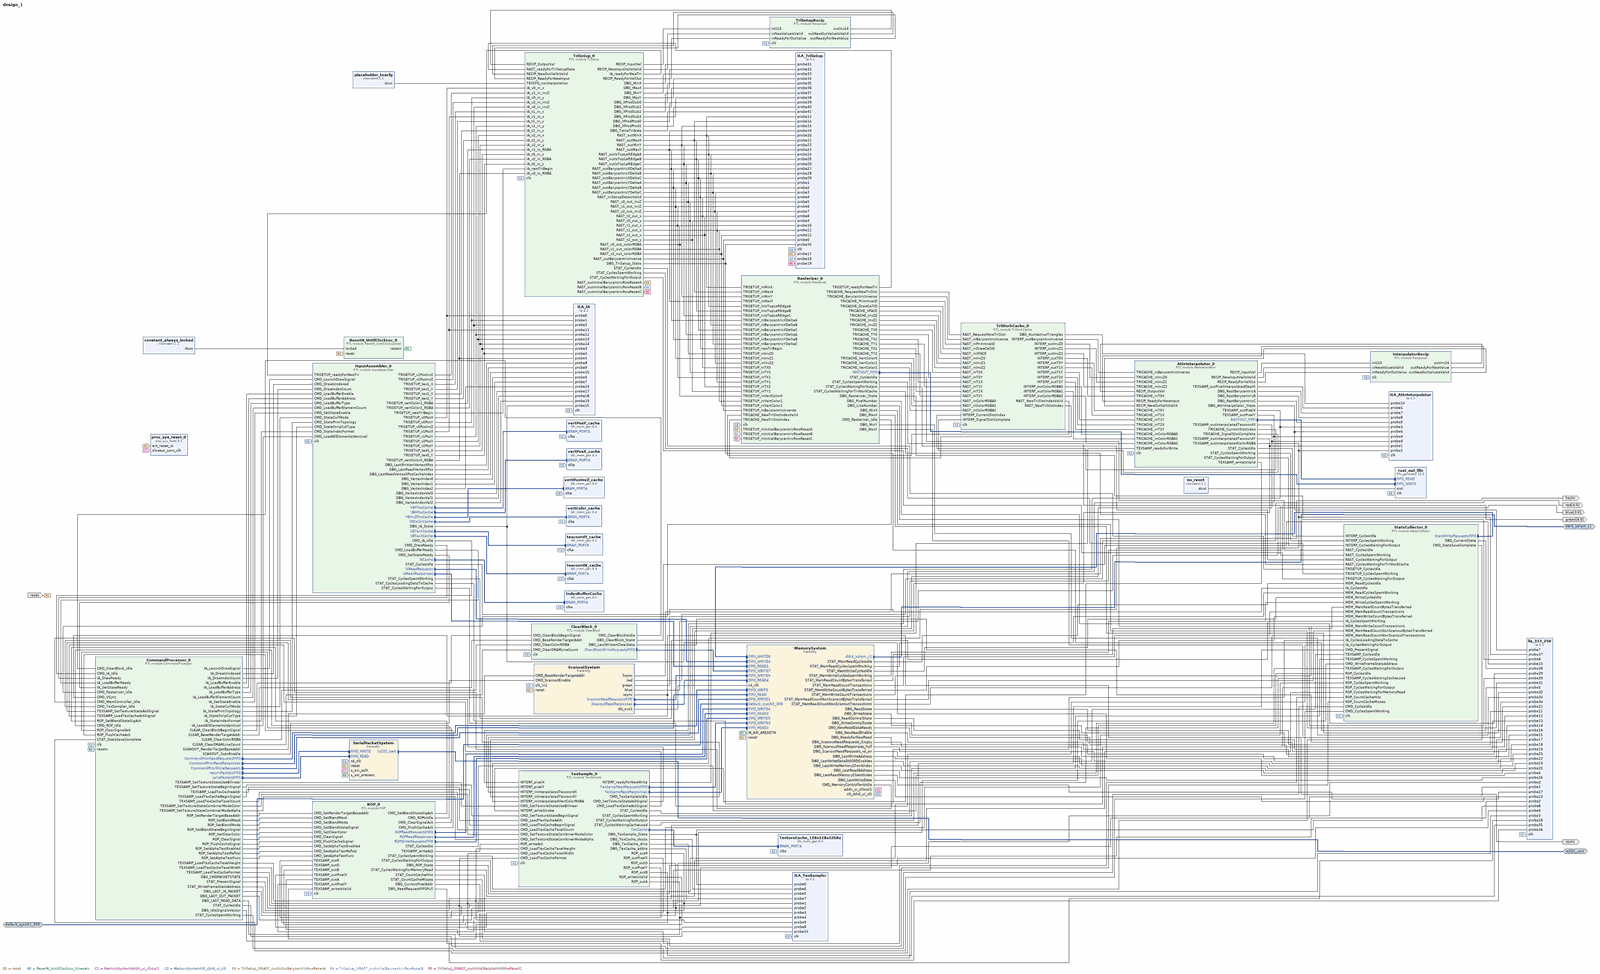
[diagram p0: block diagram of the top level, whole]
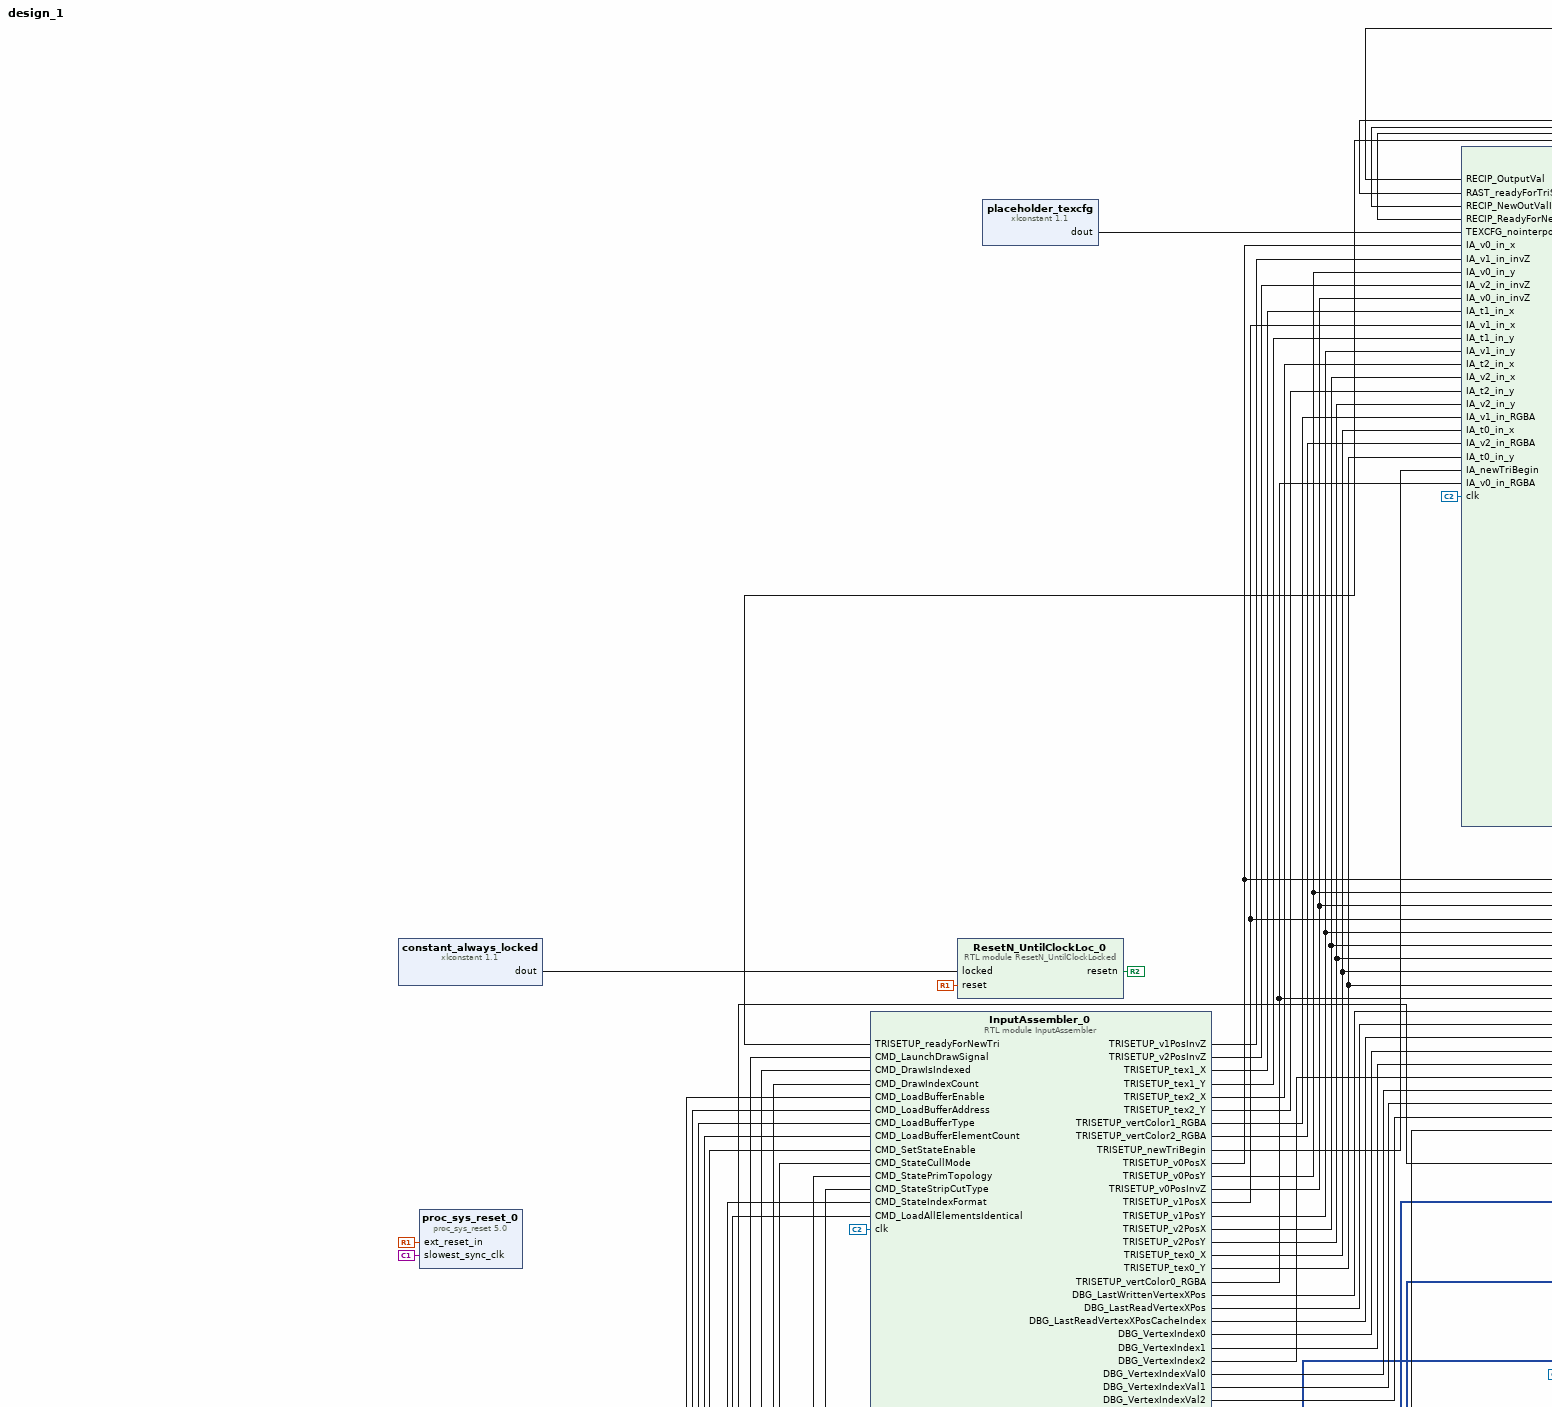
[diagram p1: block diagram of the top level, upper left part]
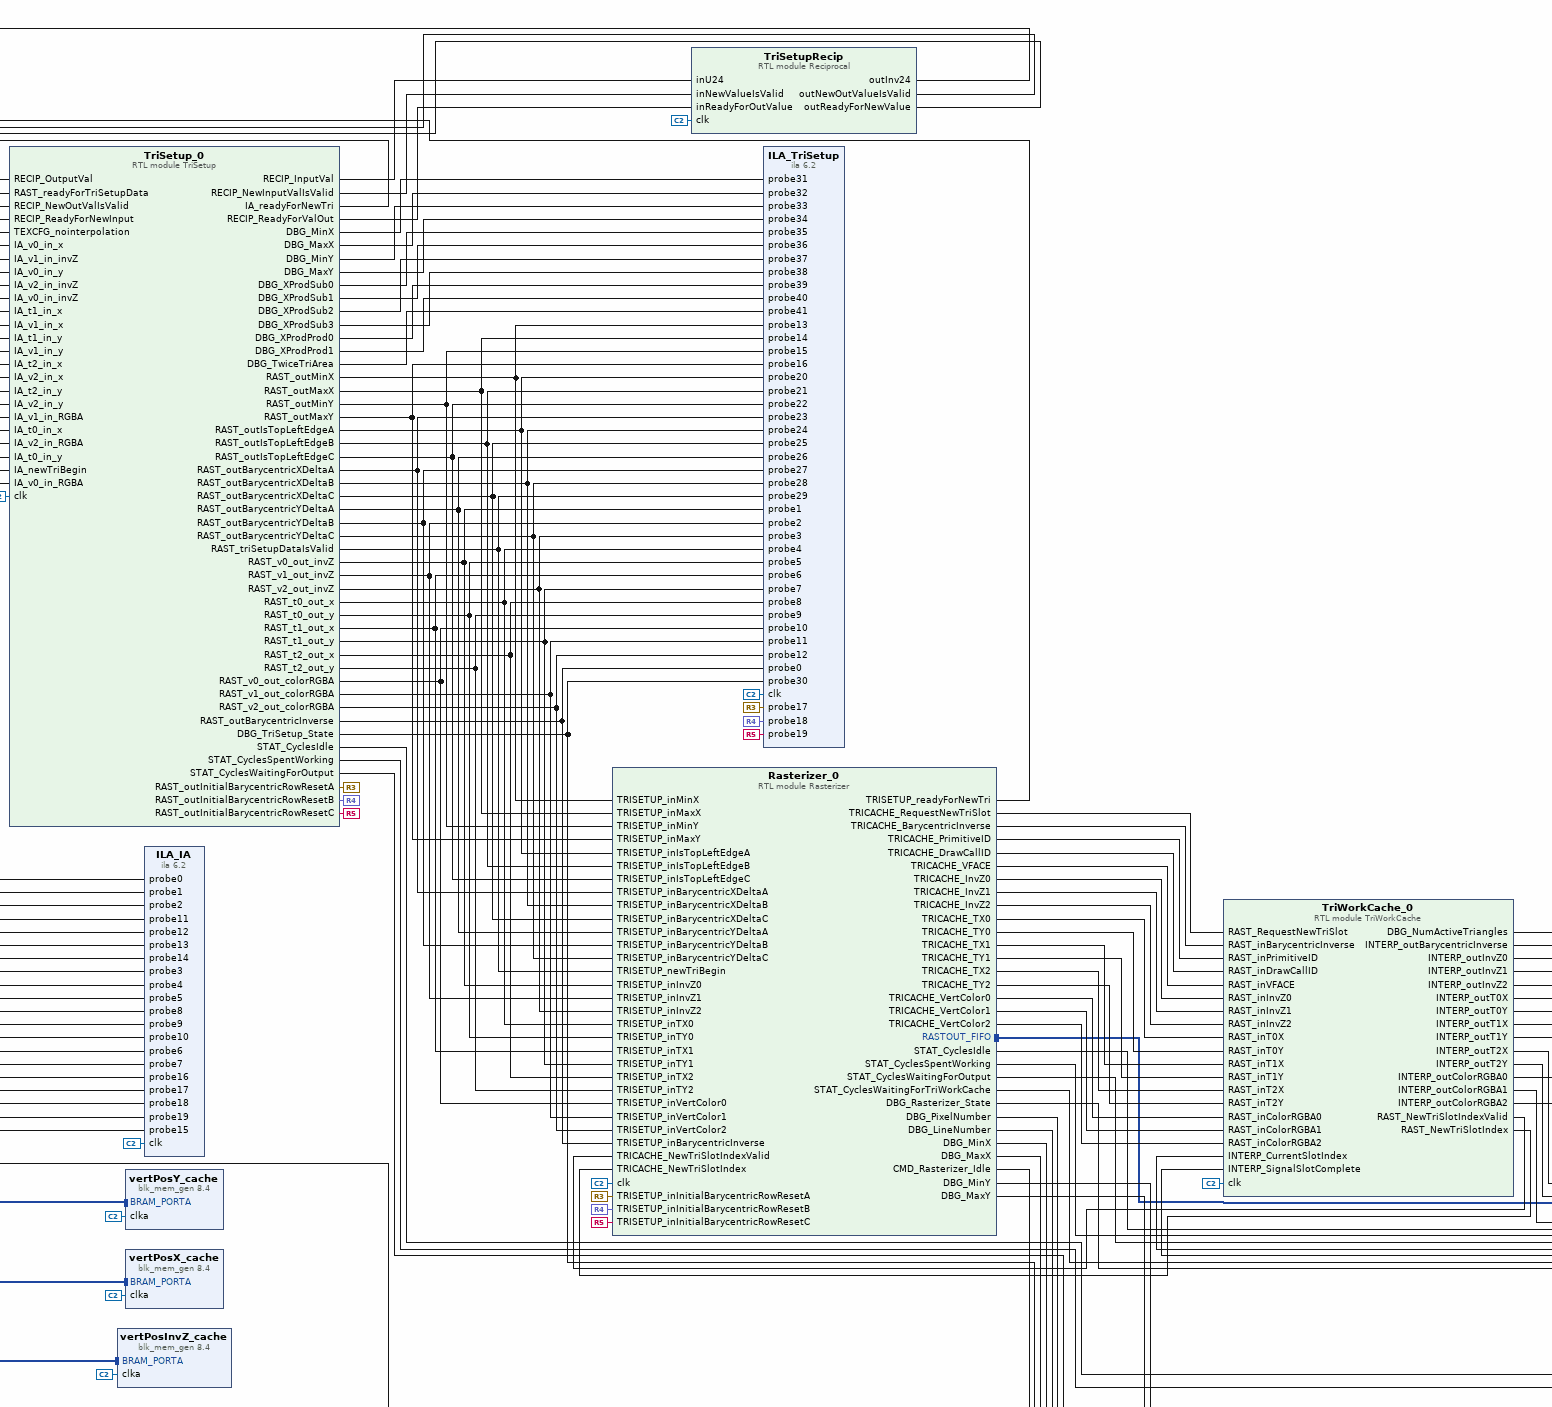
[diagram p2: block diagram of the top level, upper centre part]
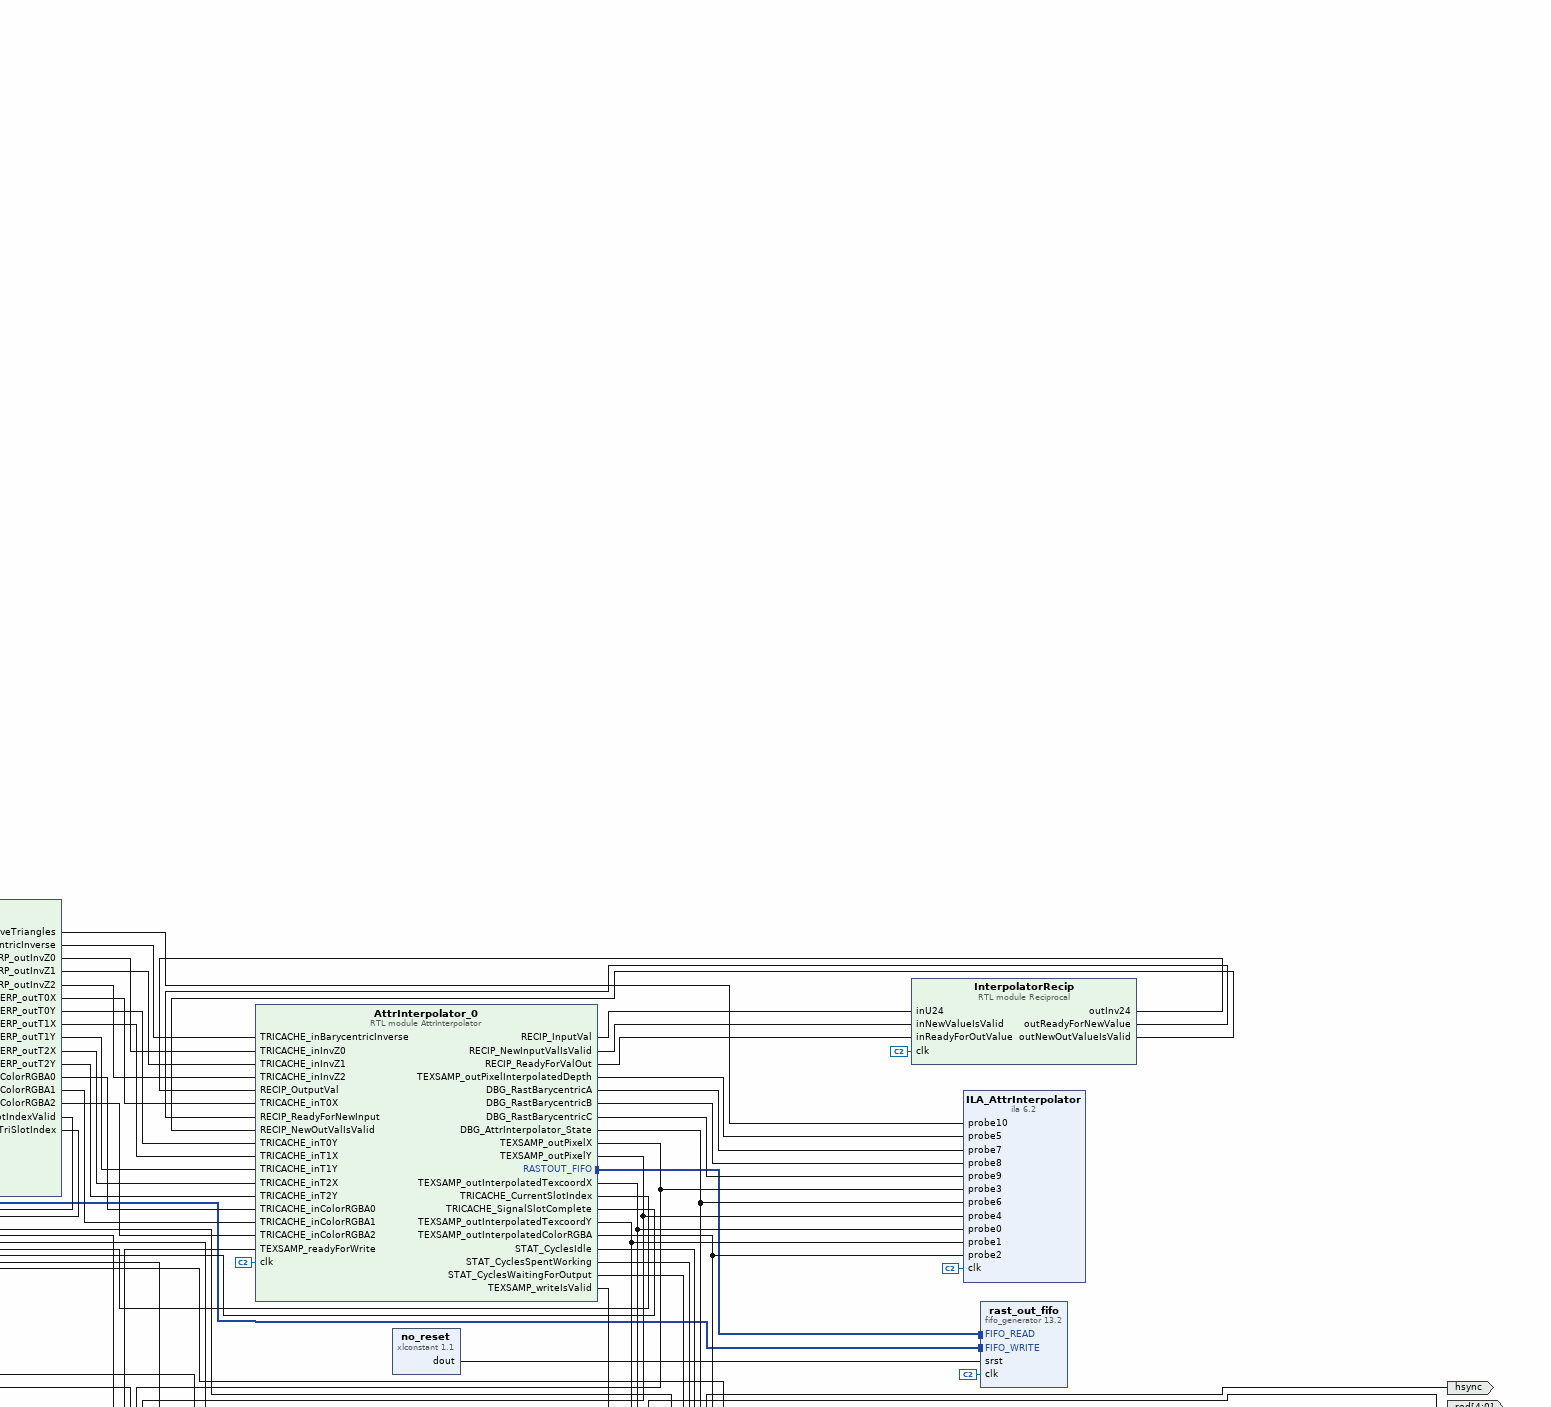
[diagram p3: block diagram of the top level, upper right part]
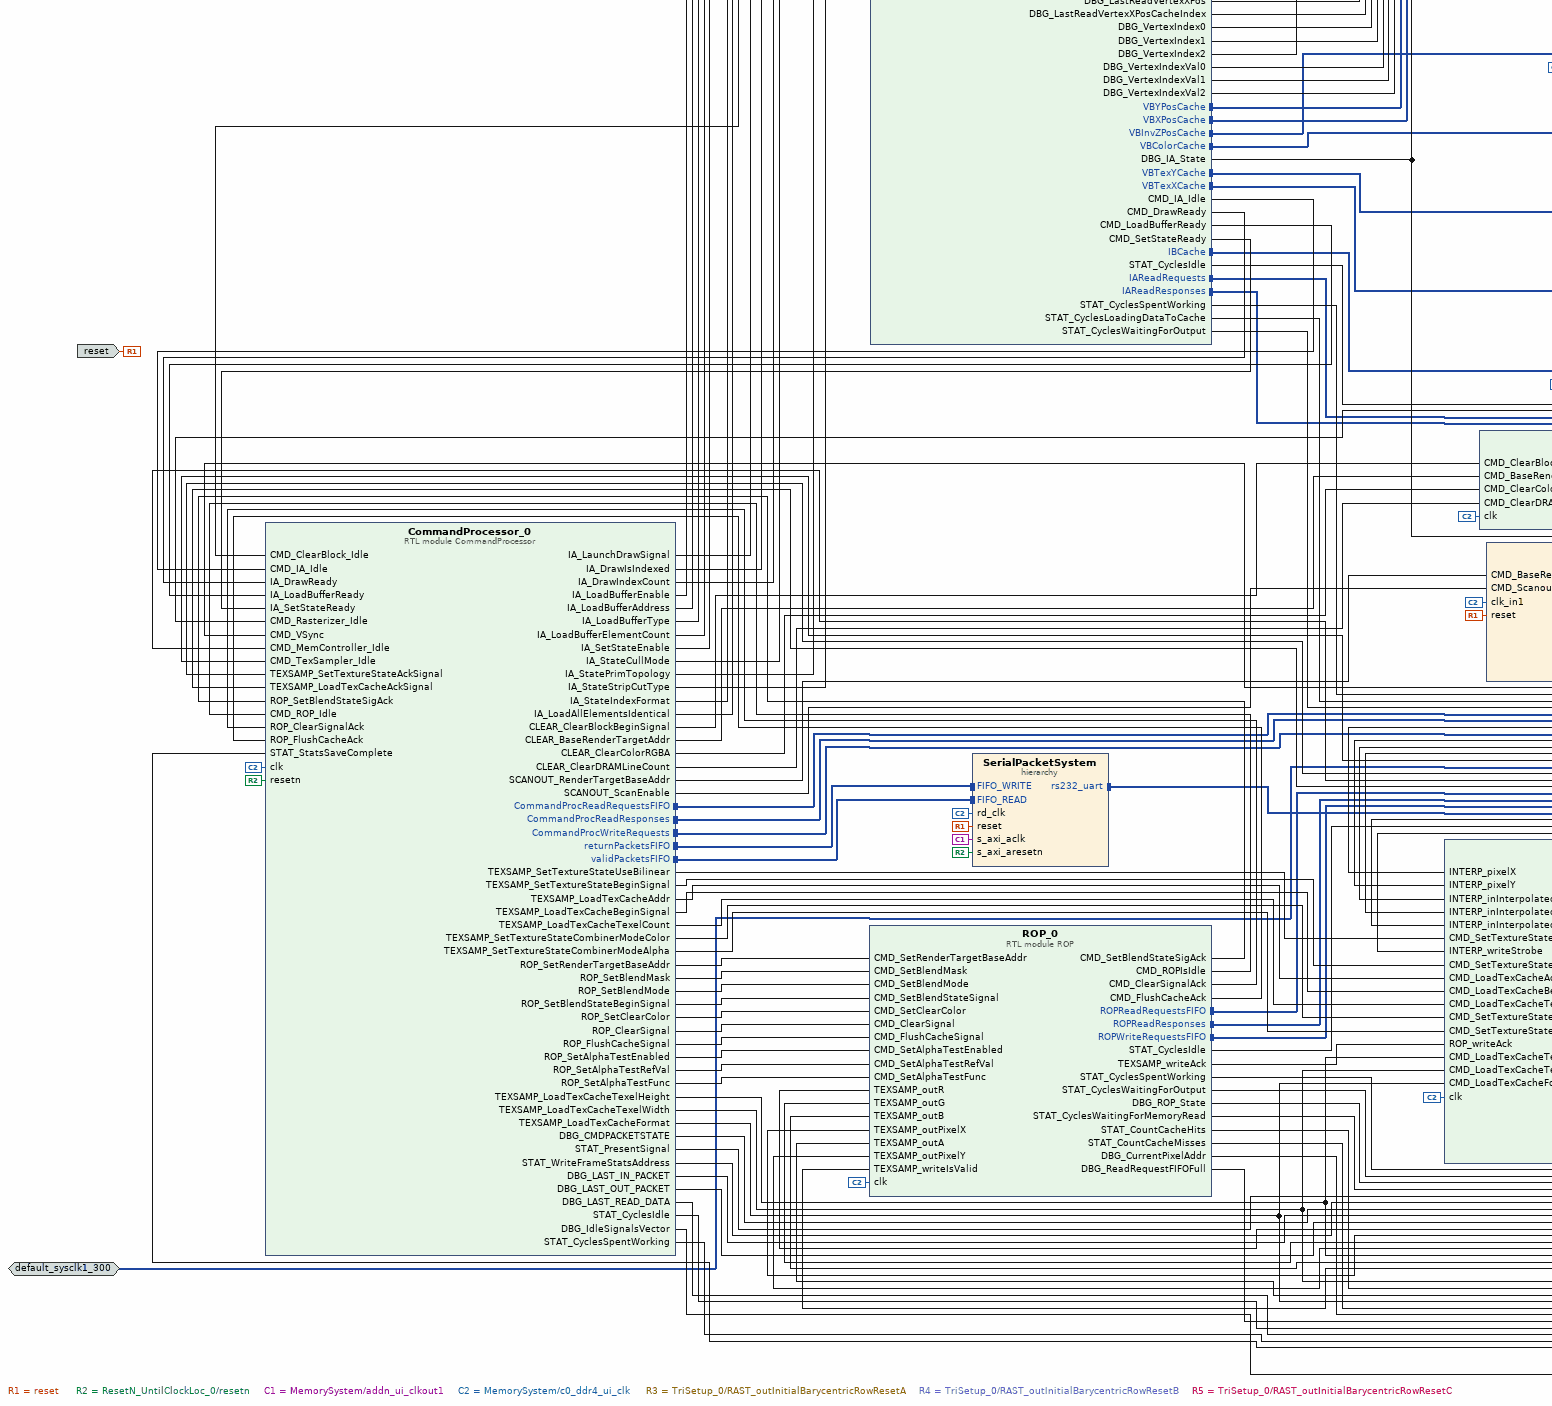
[diagram p4: block diagram of the top level, lower left part]
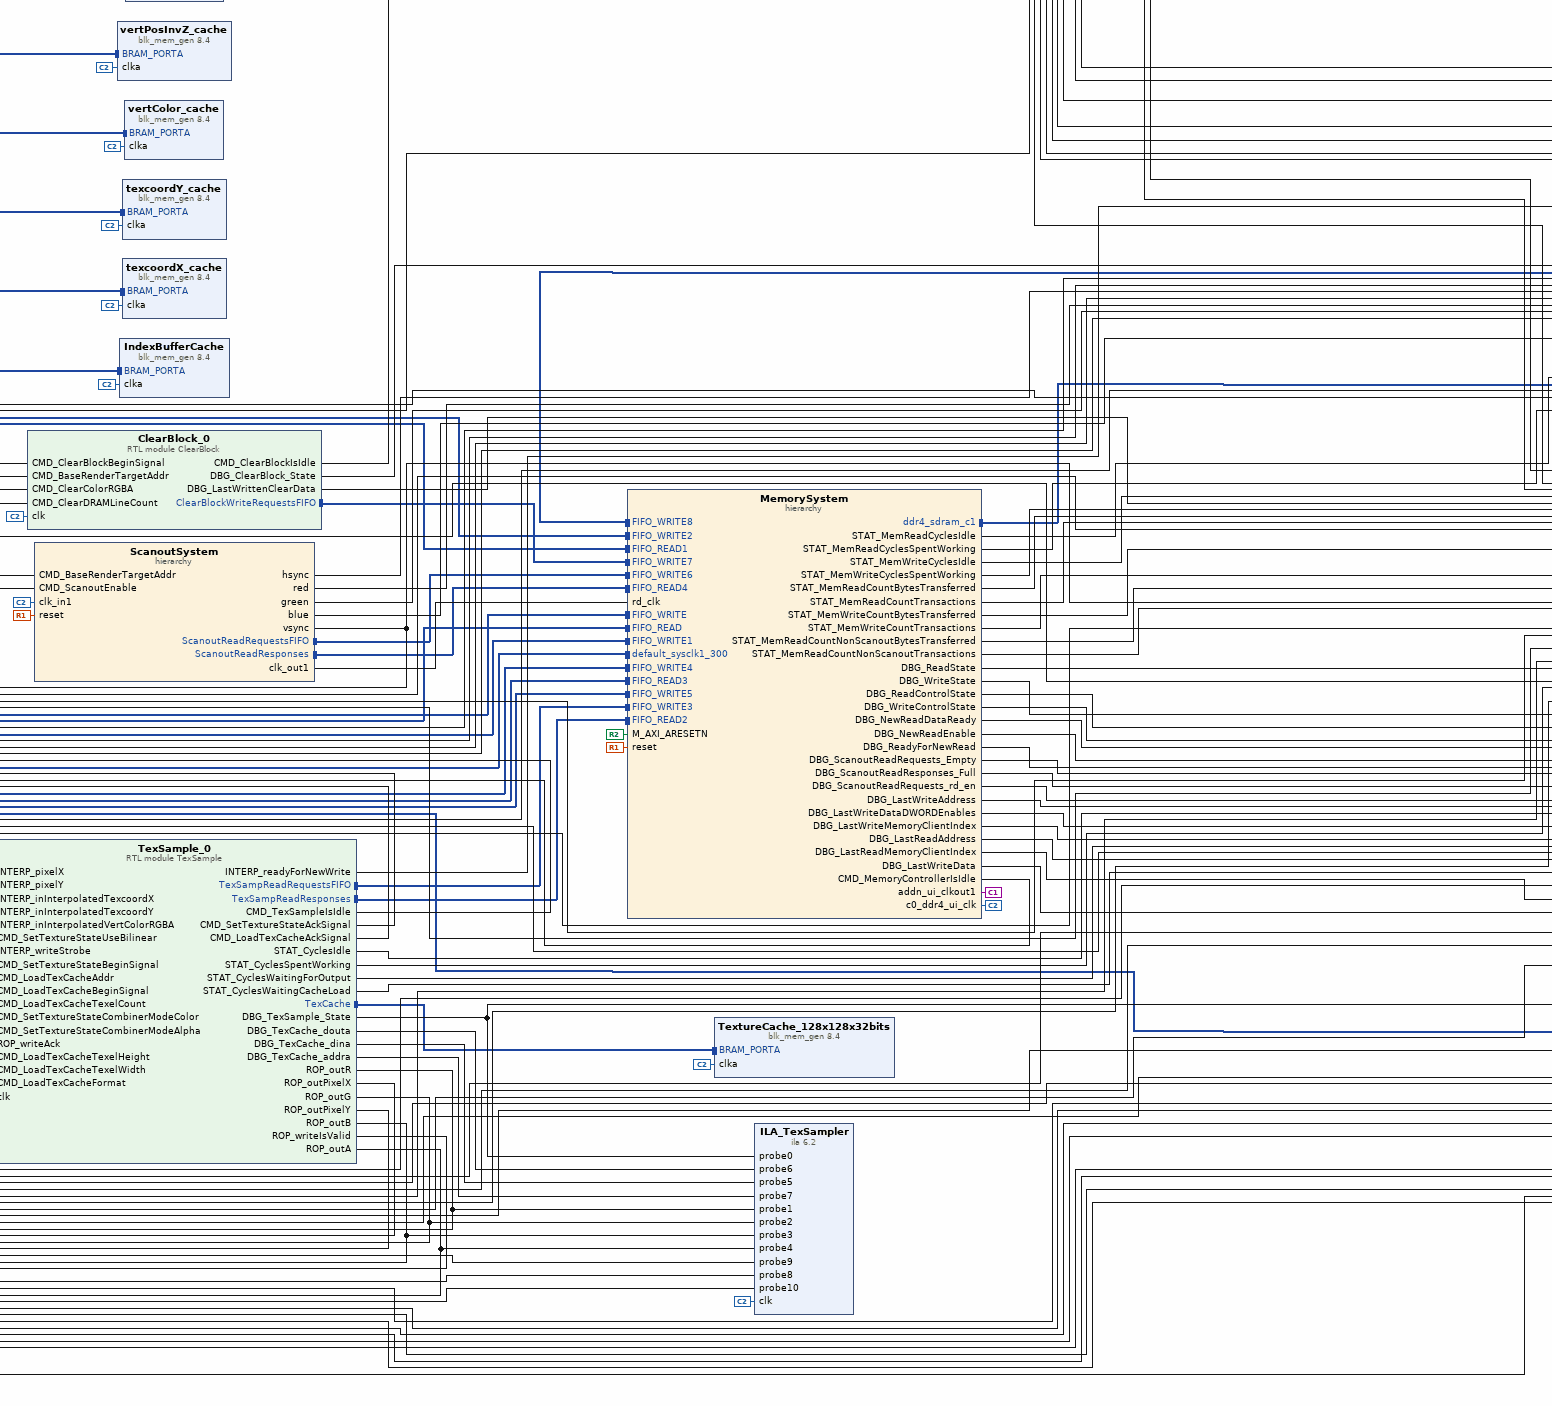
[diagram p5: block diagram of the top level, lower centre part]
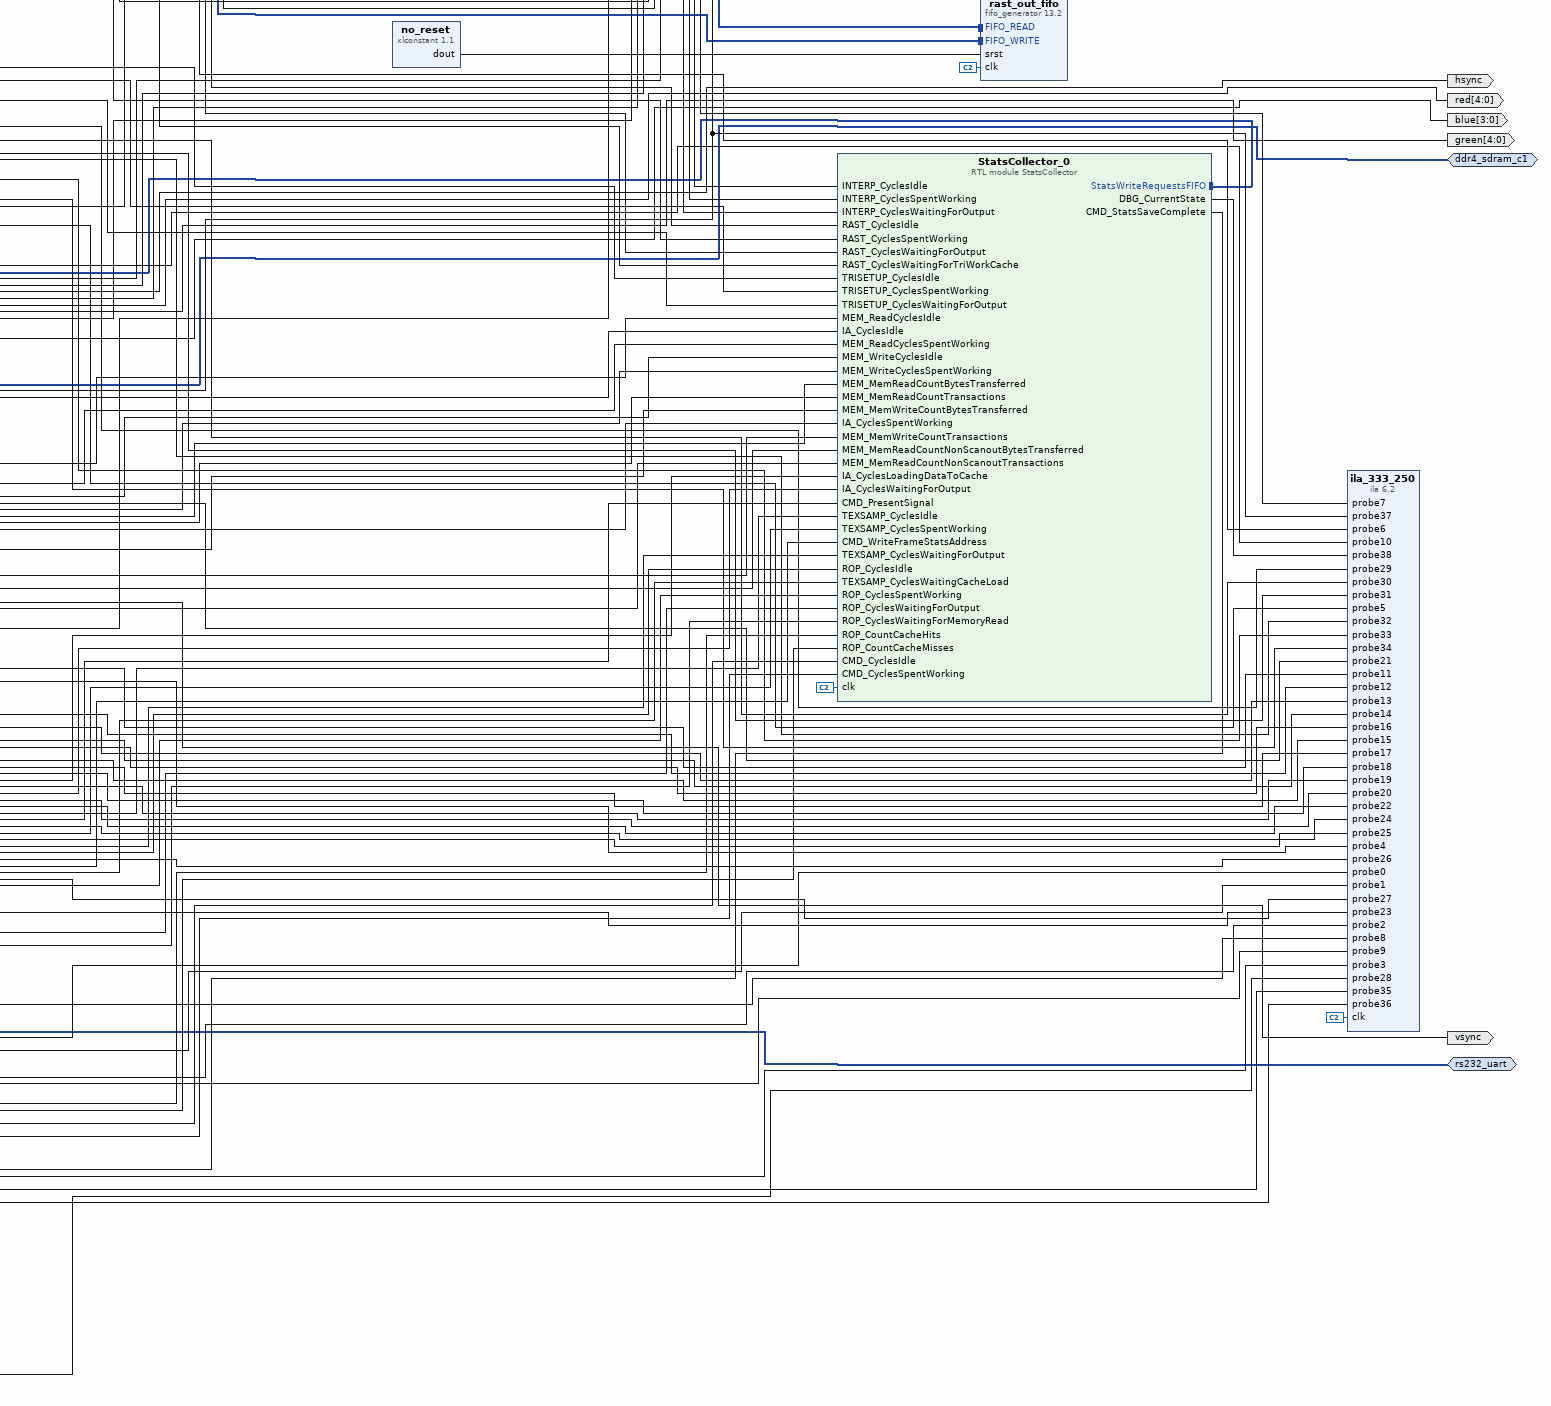
[diagram p6: block diagram of the top level, lower right part]
# Vivado block design design_1, xcku5p-ffvb676-2-e, Vivado 2018.1
create_bd_design design_1

create_bd_intf_port -mode Master -vlnv xilinx.com:interface:uart_rtl:1.0 rs232_uart
create_bd_intf_port -mode Slave -vlnv xilinx.com:interface:diff_clock_rtl:1.0 default_sysclk1_300
set_property -dict {CONFIG.FREQ_HZ 300000000} [get_bd_intf_ports default_sysclk1_300]
create_bd_intf_port -mode Master -vlnv xilinx.com:interface:ddr4_rtl:1.0 ddr4_sdram_c1
create_bd_port -dir I -type rst reset
set_property -dict {CONFIG.POLARITY ACTIVE_HIGH} [get_bd_ports reset]
create_bd_port -dir O -type data vsync
create_bd_port -dir O -type data hsync
create_bd_port -dir O -from 4 -to 0 -type data red
create_bd_port -dir O -from 4 -to 0 -type data green
create_bd_port -dir O -from 3 -to 0 -type data blue

create_bd_cell -type ip -vlnv xilinx.com:ip:ila:6.2 ila_333_250
set_property -dict [list \
  CONFIG.C_PROBE34_TYPE 0 \
  CONFIG.C_PROBE33_TYPE 0 \
  CONFIG.C_PROBE32_TYPE 0 \
  CONFIG.C_PROBE31_TYPE 0 \
  CONFIG.C_PROBE30_TYPE 0 \
  CONFIG.C_PROBE29_TYPE 0 \
  CONFIG.C_PROBE28_TYPE 0 \
  CONFIG.C_PROBE27_TYPE 0 \
  CONFIG.C_PROBE26_TYPE 0 \
  CONFIG.C_PROBE25_TYPE 0 \
  CONFIG.C_PROBE24_TYPE 0 \
  CONFIG.C_PROBE23_TYPE 0 \
  CONFIG.C_PROBE22_TYPE 0 \
  CONFIG.C_PROBE21_TYPE 0 \
  CONFIG.C_PROBE20_TYPE 0 \
  CONFIG.C_PROBE19_TYPE 0 \
  CONFIG.C_PROBE18_TYPE 0 \
  CONFIG.C_PROBE17_TYPE 0 \
  CONFIG.C_PROBE16_TYPE 0 \
  CONFIG.C_PROBE15_TYPE 0 \
  CONFIG.C_PROBE14_TYPE 0 \
  CONFIG.C_PROBE13_TYPE 0 \
  CONFIG.C_PROBE12_TYPE 0 \
  CONFIG.C_PROBE11_TYPE 0 \
  CONFIG.C_PROBE10_TYPE 0 \
  CONFIG.C_PROBE9_TYPE 0 \
  CONFIG.C_PROBE8_TYPE 0 \
  CONFIG.C_PROBE7_TYPE 0 \
  CONFIG.C_PROBE6_TYPE 0 \
  CONFIG.C_PROBE5_TYPE 0 \
  CONFIG.C_PROBE4_TYPE 0 \
  CONFIG.C_PROBE3_TYPE 0 \
  CONFIG.C_PROBE2_TYPE 0 \
  CONFIG.C_PROBE1_TYPE 0 \
  CONFIG.C_PROBE0_TYPE 0 \
  CONFIG.C_PROBE41_WIDTH 1 \
  CONFIG.C_PROBE40_WIDTH 1 \
  CONFIG.C_PROBE39_WIDTH 1 \
  CONFIG.C_PROBE38_WIDTH 4 \
  CONFIG.C_PROBE37_WIDTH 32 \
  CONFIG.C_PROBE35_WIDTH 30 \
  CONFIG.C_PROBE34_WIDTH 16 \
  CONFIG.C_PROBE33_WIDTH 16 \
  CONFIG.C_PROBE32_WIDTH 16 \
  CONFIG.C_PROBE31_WIDTH 16 \
  CONFIG.C_PROBE30_WIDTH 16 \
  CONFIG.C_PROBE29_WIDTH 16 \
  CONFIG.C_PROBE28_WIDTH 7 \
  CONFIG.C_PROBE27_WIDTH 3 \
  CONFIG.C_PROBE26_WIDTH 30 \
  CONFIG.C_PROBE25_WIDTH 3 \
  CONFIG.C_PROBE24_WIDTH 8 \
  CONFIG.C_PROBE23_WIDTH 256 \
  CONFIG.C_PROBE22_WIDTH 30 \
  CONFIG.C_PROBE21_WIDTH 294 \
  CONFIG.C_PROBE14_WIDTH 4 \
  CONFIG.C_PROBE13_WIDTH 4 \
  CONFIG.C_PROBE12_WIDTH 4 \
  CONFIG.C_PROBE11_WIDTH 4 \
  CONFIG.C_PROBE10_WIDTH 4 \
  CONFIG.C_PROBE9_WIDTH 4 \
  CONFIG.C_PROBE8_WIDTH 6 \
  CONFIG.C_PROBE7_WIDTH 6 \
  CONFIG.C_PROBE6_WIDTH 4 \
  CONFIG.C_PROBE5_WIDTH 8 \
  CONFIG.C_PROBE4_WIDTH 6 \
  CONFIG.C_PROBE3_WIDTH 32 \
  CONFIG.C_PROBE2_WIDTH 88 \
  CONFIG.C_PROBE1_WIDTH 88 \
  CONFIG.C_PROBE0_WIDTH 8 \
  CONFIG.C_NUM_OF_PROBES 39 \
  CONFIG.C_ENABLE_ILA_AXI_MON false \
  CONFIG.C_MONITOR_TYPE Native \
] [get_bd_cells ila_333_250]
create_bd_cell -type ip -vlnv xilinx.com:ip:xlconstant:1.1 constant_always_locked
create_bd_cell -type ip -vlnv xilinx.com:ip:proc_sys_reset:5.0 proc_sys_reset_0
set_property -dict {CONFIG.RESET_BOARD_INTERFACE reset} [get_bd_cells proc_sys_reset_0]
create_bd_cell -type hier MemorySystem
create_bd_cell -type hier SerialPacketSystem
create_bd_cell -type ip -vlnv xilinx.com:ip:xlconstant:1.1 placeholder_texcfg
set_property -dict {CONFIG.CONST_VAL 0} [get_bd_cells placeholder_texcfg]
create_bd_cell -type ip -vlnv xilinx.com:ip:blk_mem_gen:8.4 IndexBufferCache
set_property -dict [list \
  CONFIG.Enable_32bit_Address false \
  CONFIG.Use_Byte_Write_Enable false \
  CONFIG.Algorithm Minimum_Area \
  CONFIG.Write_Width_A 16 \
  CONFIG.Write_Depth_A 2048 \
  CONFIG.Read_Width_A 16 \
  CONFIG.Operating_Mode_A NO_CHANGE \
  CONFIG.Register_PortA_Output_of_Memory_Primitives false \
  CONFIG.Fill_Remaining_Memory_Locations true \
  CONFIG.Use_RSTA_Pin false \
  CONFIG.use_bram_block Stand_Alone \
] [get_bd_cells IndexBufferCache]
create_bd_cell -type ip -vlnv xilinx.com:ip:fifo_generator:13.2 rast_out_fifo
set_property -dict [list \
  CONFIG.Performance_Options First_Word_Fall_Through \
  CONFIG.asymmetric_port_width false \
  CONFIG.Input_Data_Width 128 \
  CONFIG.Input_Depth 512 \
  CONFIG.Use_Embedded_Registers true \
] [get_bd_cells rast_out_fifo]
create_bd_cell -type ip -vlnv xilinx.com:ip:xlconstant:1.1 no_reset
set_property -dict {CONFIG.CONST_VAL 0} [get_bd_cells no_reset]
create_bd_cell -type ip -vlnv xilinx.com:ip:blk_mem_gen:8.4 TextureCache_128x128x32bits
set_property -dict [list \
  CONFIG.Memory_Type Single_Port_RAM \
  CONFIG.PRIM_type_to_Implement URAM \
  CONFIG.Enable_32bit_Address false \
  CONFIG.Use_Byte_Write_Enable false \
  CONFIG.Write_Width_A 32 \
  CONFIG.Write_Depth_A 16384 \
  CONFIG.Operating_Mode_A NO_CHANGE \
  CONFIG.Register_PortA_Output_of_Memory_Primitives false \
  CONFIG.Use_RSTA_Pin false \
  CONFIG.Port_B_Clock 0 \
  CONFIG.Port_B_Write_Rate 0 \
  CONFIG.Port_B_Enable_Rate 0 \
  CONFIG.use_bram_block Stand_Alone \
] [get_bd_cells TextureCache_128x128x32bits]
create_bd_cell -type module -reference ResetN_UntilClockLocked ResetN_UntilClockLoc_0
create_bd_cell -type hier ScanoutSystem
create_bd_cell -type module -reference ClearBlock ClearBlock_0
create_bd_cell -type ip -vlnv xilinx.com:ip:ila:6.2 ILA_IA
set_property -dict [list \
  CONFIG.C_PROBE5_TYPE 0 \
  CONFIG.C_PROBE4_TYPE 0 \
  CONFIG.C_PROBE3_TYPE 0 \
  CONFIG.C_PROBE2_TYPE 0 \
  CONFIG.C_PROBE1_TYPE 0 \
  CONFIG.C_PROBE0_TYPE 0 \
  CONFIG.C_PROBE19_WIDTH 16 \
  CONFIG.C_PROBE18_WIDTH 16 \
  CONFIG.C_PROBE17_WIDTH 16 \
  CONFIG.C_PROBE16_WIDTH 16 \
  CONFIG.C_PROBE15_WIDTH 6 \
  CONFIG.C_PROBE14_WIDTH 16 \
  CONFIG.C_PROBE13_WIDTH 16 \
  CONFIG.C_PROBE12_WIDTH 16 \
  CONFIG.C_PROBE11_WIDTH 16 \
  CONFIG.C_PROBE10_WIDTH 16 \
  CONFIG.C_PROBE9_WIDTH 16 \
  CONFIG.C_PROBE8_WIDTH 32 \
  CONFIG.C_PROBE7_WIDTH 16 \
  CONFIG.C_PROBE6_WIDTH 16 \
  CONFIG.C_PROBE5_WIDTH 32 \
  CONFIG.C_PROBE4_WIDTH 16 \
  CONFIG.C_PROBE3_WIDTH 16 \
  CONFIG.C_PROBE2_WIDTH 24 \
  CONFIG.C_PROBE1_WIDTH 16 \
  CONFIG.C_PROBE0_WIDTH 16 \
  CONFIG.C_NUM_OF_PROBES 20 \
  CONFIG.ALL_PROBE_SAME_MU true \
  CONFIG.C_ENABLE_ILA_AXI_MON false \
  CONFIG.C_MONITOR_TYPE Native \
] [get_bd_cells ILA_IA]
create_bd_cell -type ip -vlnv xilinx.com:ip:blk_mem_gen:8.4 vertPosX_cache
set_property -dict [list \
  CONFIG.Enable_32bit_Address false \
  CONFIG.Use_Byte_Write_Enable false \
  CONFIG.Write_Width_A 16 \
  CONFIG.Write_Depth_A 1024 \
  CONFIG.Read_Width_A 16 \
  CONFIG.Operating_Mode_A NO_CHANGE \
  CONFIG.Register_PortA_Output_of_Memory_Primitives false \
  CONFIG.Use_RSTA_Pin false \
  CONFIG.use_bram_block Stand_Alone \
] [get_bd_cells vertPosX_cache]
create_bd_cell -type ip -vlnv xilinx.com:ip:blk_mem_gen:8.4 vertPosY_cache
set_property -dict [list \
  CONFIG.Enable_32bit_Address false \
  CONFIG.Use_Byte_Write_Enable false \
  CONFIG.Write_Width_A 16 \
  CONFIG.Write_Depth_A 1024 \
  CONFIG.Read_Width_A 16 \
  CONFIG.Operating_Mode_A NO_CHANGE \
  CONFIG.Register_PortA_Output_of_Memory_Primitives false \
  CONFIG.Use_RSTA_Pin false \
  CONFIG.use_bram_block Stand_Alone \
] [get_bd_cells vertPosY_cache]
create_bd_cell -type ip -vlnv xilinx.com:ip:blk_mem_gen:8.4 vertPosInvZ_cache
set_property -dict [list \
  CONFIG.Enable_32bit_Address false \
  CONFIG.Use_Byte_Write_Enable false \
  CONFIG.Write_Depth_A 1024 \
  CONFIG.Operating_Mode_A NO_CHANGE \
  CONFIG.Register_PortA_Output_of_Memory_Primitives false \
  CONFIG.Use_RSTA_Pin false \
  CONFIG.use_bram_block Stand_Alone \
] [get_bd_cells vertPosInvZ_cache]
create_bd_cell -type ip -vlnv xilinx.com:ip:blk_mem_gen:8.4 texcoordX_cache
set_property -dict [list \
  CONFIG.Enable_32bit_Address false \
  CONFIG.Use_Byte_Write_Enable false \
  CONFIG.Write_Width_A 16 \
  CONFIG.Write_Depth_A 1024 \
  CONFIG.Read_Width_A 16 \
  CONFIG.Operating_Mode_A NO_CHANGE \
  CONFIG.Register_PortA_Output_of_Memory_Primitives false \
  CONFIG.Use_RSTA_Pin false \
  CONFIG.use_bram_block Stand_Alone \
] [get_bd_cells texcoordX_cache]
create_bd_cell -type ip -vlnv xilinx.com:ip:blk_mem_gen:8.4 texcoordY_cache
set_property -dict [list \
  CONFIG.Enable_32bit_Address false \
  CONFIG.Use_Byte_Write_Enable false \
  CONFIG.Write_Width_A 16 \
  CONFIG.Write_Depth_A 1024 \
  CONFIG.Read_Width_A 16 \
  CONFIG.Operating_Mode_A NO_CHANGE \
  CONFIG.Register_PortA_Output_of_Memory_Primitives false \
  CONFIG.Use_RSTA_Pin false \
  CONFIG.use_bram_block Stand_Alone \
] [get_bd_cells texcoordY_cache]
create_bd_cell -type ip -vlnv xilinx.com:ip:blk_mem_gen:8.4 vertColor_cache
set_property -dict [list \
  CONFIG.Enable_32bit_Address false \
  CONFIG.Use_Byte_Write_Enable false \
  CONFIG.Write_Depth_A 1024 \
  CONFIG.Operating_Mode_A NO_CHANGE \
  CONFIG.Register_PortA_Output_of_Memory_Primitives false \
  CONFIG.Use_RSTA_Pin false \
  CONFIG.use_bram_block Stand_Alone \
] [get_bd_cells vertColor_cache]
create_bd_cell -type ip -vlnv xilinx.com:ip:ila:6.2 ILA_TriSetup
set_property -dict [list \
  CONFIG.C_PROBE41_WIDTH 32 \
  CONFIG.C_PROBE40_WIDTH 32 \
  CONFIG.C_PROBE39_WIDTH 32 \
  CONFIG.C_PROBE38_WIDTH 16 \
  CONFIG.C_PROBE37_WIDTH 16 \
  CONFIG.C_PROBE36_WIDTH 16 \
  CONFIG.C_PROBE35_WIDTH 16 \
  CONFIG.C_PROBE34_WIDTH 16 \
  CONFIG.C_PROBE33_WIDTH 16 \
  CONFIG.C_PROBE32_WIDTH 16 \
  CONFIG.C_PROBE31_WIDTH 16 \
  CONFIG.C_PROBE30_WIDTH 8 \
  CONFIG.C_PROBE28_WIDTH 16 \
  CONFIG.C_PROBE27_WIDTH 16 \
  CONFIG.C_PROBE26_WIDTH 16 \
  CONFIG.C_PROBE25_WIDTH 16 \
  CONFIG.C_PROBE24_WIDTH 16 \
  CONFIG.C_PROBE23_WIDTH 16 \
  CONFIG.C_PROBE19_WIDTH 32 \
  CONFIG.C_PROBE18_WIDTH 32 \
  CONFIG.C_PROBE17_WIDTH 32 \
  CONFIG.C_PROBE16_WIDTH 16 \
  CONFIG.C_PROBE15_WIDTH 16 \
  CONFIG.C_PROBE14_WIDTH 16 \
  CONFIG.C_PROBE13_WIDTH 16 \
  CONFIG.C_PROBE12_WIDTH 32 \
  CONFIG.C_PROBE11_WIDTH 32 \
  CONFIG.C_PROBE10_WIDTH 32 \
  CONFIG.C_PROBE9_WIDTH 16 \
  CONFIG.C_PROBE8_WIDTH 16 \
  CONFIG.C_PROBE7_WIDTH 16 \
  CONFIG.C_PROBE6_WIDTH 16 \
  CONFIG.C_PROBE5_WIDTH 16 \
  CONFIG.C_PROBE4_WIDTH 16 \
  CONFIG.C_PROBE3_WIDTH 24 \
  CONFIG.C_PROBE2_WIDTH 24 \
  CONFIG.C_PROBE1_WIDTH 24 \
  CONFIG.C_PROBE0_WIDTH 24 \
  CONFIG.C_NUM_OF_PROBES 42 \
  CONFIG.C_ENABLE_ILA_AXI_MON false \
  CONFIG.C_MONITOR_TYPE Native \
] [get_bd_cells ILA_TriSetup]
create_bd_cell -type ip -vlnv xilinx.com:ip:ila:6.2 ILA_AttrInterpolator
set_property -dict [list \
  CONFIG.C_PROBE16_WIDTH 1 \
  CONFIG.C_PROBE15_WIDTH 1 \
  CONFIG.C_PROBE14_WIDTH 1 \
  CONFIG.C_PROBE13_WIDTH 1 \
  CONFIG.C_PROBE12_WIDTH 1 \
  CONFIG.C_PROBE11_WIDTH 1 \
  CONFIG.C_PROBE10_WIDTH 3 \
  CONFIG.C_PROBE9_WIDTH 32 \
  CONFIG.C_PROBE8_WIDTH 32 \
  CONFIG.C_PROBE7_WIDTH 32 \
  CONFIG.C_PROBE6_WIDTH 6 \
  CONFIG.C_PROBE5_WIDTH 24 \
  CONFIG.C_PROBE4_WIDTH 16 \
  CONFIG.C_PROBE3_WIDTH 16 \
  CONFIG.C_PROBE2_WIDTH 32 \
  CONFIG.C_PROBE1_WIDTH 16 \
  CONFIG.C_PROBE0_WIDTH 16 \
  CONFIG.C_NUM_OF_PROBES 11 \
  CONFIG.C_ENABLE_ILA_AXI_MON false \
  CONFIG.C_MONITOR_TYPE Native \
] [get_bd_cells ILA_AttrInterpolator]
create_bd_cell -type ip -vlnv xilinx.com:ip:ila:6.2 ILA_TexSampler
set_property -dict [list \
  CONFIG.C_PROBE10_WIDTH 3 \
  CONFIG.C_PROBE9_WIDTH 3 \
  CONFIG.C_PROBE8_WIDTH 3 \
  CONFIG.C_PROBE7_WIDTH 14 \
  CONFIG.C_PROBE6_WIDTH 32 \
  CONFIG.C_PROBE5_WIDTH 32 \
  CONFIG.C_PROBE4_WIDTH 8 \
  CONFIG.C_PROBE3_WIDTH 8 \
  CONFIG.C_PROBE2_WIDTH 8 \
  CONFIG.C_PROBE1_WIDTH 8 \
  CONFIG.C_PROBE0_WIDTH 6 \
  CONFIG.C_NUM_OF_PROBES 11 \
  CONFIG.C_ENABLE_ILA_AXI_MON false \
  CONFIG.C_MONITOR_TYPE Native \
] [get_bd_cells ILA_TexSampler]
create_bd_cell -type module -reference Reciprocal TriSetupRecip
create_bd_cell -type module -reference Reciprocal InterpolatorRecip
create_bd_cell -type module -reference TriWorkCache TriWorkCache_0
create_bd_cell -type module -reference TriSetup TriSetup_0
create_bd_cell -type module -reference Rasterizer Rasterizer_0
create_bd_cell -type module -reference AttrInterpolator AttrInterpolator_0
create_bd_cell -type module -reference StatsCollector StatsCollector_0
create_bd_cell -type module -reference CommandProcessor CommandProcessor_0
create_bd_cell -type module -reference ROP ROP_0
create_bd_cell -type module -reference TexSample TexSample_0
create_bd_cell -type module -reference InputAssembler InputAssembler_0

# ---- hierarchy /MemorySystem ----
current_bd_instance /MemorySystem
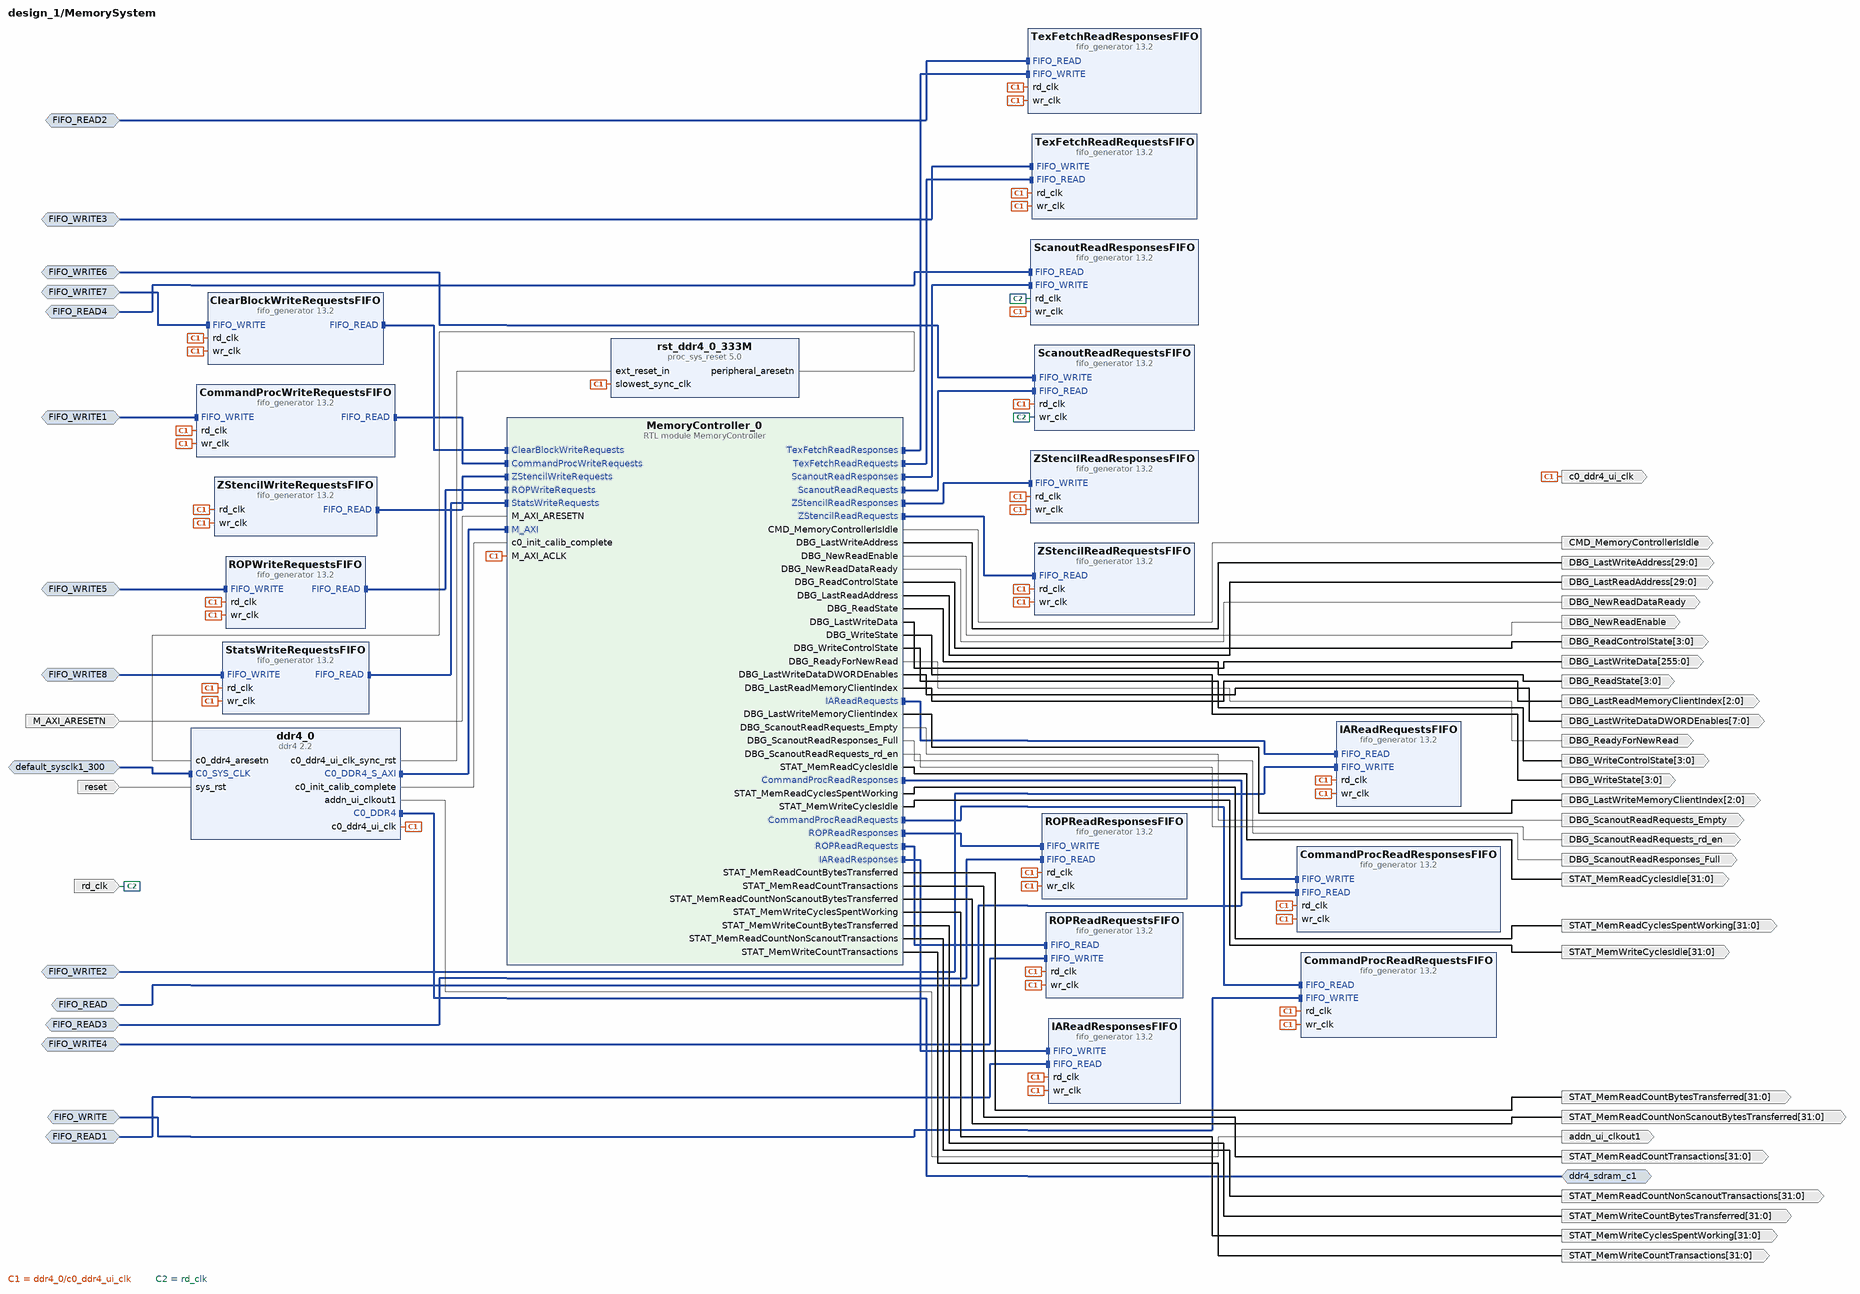
[diagram p7: block diagram inside /MemorySystem]
create_bd_intf_pin -mode Slave -vlnv xilinx.com:interface:diff_clock_rtl:1.0 default_sysclk1_300
create_bd_intf_pin -mode Master -vlnv xilinx.com:interface:ddr4_rtl:1.0 ddr4_sdram_c1
create_bd_intf_pin -mode Slave -vlnv xilinx.com:interface:fifo_write_rtl:1.0 FIFO_WRITE
create_bd_intf_pin -mode Slave -vlnv xilinx.com:interface:fifo_read_rtl:1.0 FIFO_READ
create_bd_intf_pin -mode Slave -vlnv xilinx.com:interface:fifo_write_rtl:1.0 FIFO_WRITE1
create_bd_intf_pin -mode Slave -vlnv xilinx.com:interface:fifo_write_rtl:1.0 FIFO_WRITE2
create_bd_intf_pin -mode Slave -vlnv xilinx.com:interface:fifo_read_rtl:1.0 FIFO_READ1
create_bd_intf_pin -mode Slave -vlnv xilinx.com:interface:fifo_write_rtl:1.0 FIFO_WRITE3
create_bd_intf_pin -mode Slave -vlnv xilinx.com:interface:fifo_read_rtl:1.0 FIFO_READ2
create_bd_intf_pin -mode Slave -vlnv xilinx.com:interface:fifo_write_rtl:1.0 FIFO_WRITE4
create_bd_intf_pin -mode Slave -vlnv xilinx.com:interface:fifo_read_rtl:1.0 FIFO_READ3
create_bd_intf_pin -mode Slave -vlnv xilinx.com:interface:fifo_write_rtl:1.0 FIFO_WRITE5
create_bd_intf_pin -mode Slave -vlnv xilinx.com:interface:fifo_write_rtl:1.0 FIFO_WRITE6
create_bd_intf_pin -mode Slave -vlnv xilinx.com:interface:fifo_read_rtl:1.0 FIFO_READ4
create_bd_intf_pin -mode Slave -vlnv xilinx.com:interface:fifo_write_rtl:1.0 FIFO_WRITE7
create_bd_intf_pin -mode Slave -vlnv xilinx.com:interface:fifo_write_rtl:1.0 FIFO_WRITE8
create_bd_pin -dir O -type clk c0_ddr4_ui_clk
create_bd_pin -dir I -type rst M_AXI_ARESETN
create_bd_pin -dir O -type clk addn_ui_clkout1
create_bd_pin -dir I -type rst reset
create_bd_pin -dir O CMD_MemoryControllerIsIdle
create_bd_pin -dir I -type clk rd_clk
create_bd_pin -dir O -from 3 -to 0 DBG_ReadState
create_bd_pin -dir O -from 3 -to 0 DBG_WriteState
create_bd_pin -dir O -from 3 -to 0 DBG_ReadControlState
create_bd_pin -dir O -from 3 -to 0 DBG_WriteControlState
create_bd_pin -dir O DBG_NewReadEnable
create_bd_pin -dir O DBG_NewReadDataReady
create_bd_pin -dir O DBG_ReadyForNewRead
create_bd_pin -dir O DBG_ScanoutReadRequests_Empty
create_bd_pin -dir O DBG_ScanoutReadResponses_Full
create_bd_pin -dir O DBG_ScanoutReadRequests_rd_en
create_bd_pin -dir O -from 29 -to 0 DBG_LastWriteAddress
create_bd_pin -dir O -from 255 -to 0 DBG_LastWriteData
create_bd_pin -dir O -from 7 -to 0 DBG_LastWriteDataDWORDEnables
create_bd_pin -dir O -from 2 -to 0 DBG_LastWriteMemoryClientIndex
create_bd_pin -dir O -from 29 -to 0 DBG_LastReadAddress
create_bd_pin -dir O -from 2 -to 0 DBG_LastReadMemoryClientIndex
create_bd_pin -dir O -from 31 -to 0 STAT_MemReadCyclesIdle
create_bd_pin -dir O -from 31 -to 0 STAT_MemReadCyclesSpentWorking
create_bd_pin -dir O -from 31 -to 0 STAT_MemWriteCyclesIdle
create_bd_pin -dir O -from 31 -to 0 STAT_MemWriteCyclesSpentWorking
create_bd_pin -dir O -from 31 -to 0 STAT_MemReadCountBytesTransferred
create_bd_pin -dir O -from 31 -to 0 STAT_MemReadCountTransactions
create_bd_pin -dir O -from 31 -to 0 STAT_MemWriteCountBytesTransferred
create_bd_pin -dir O -from 31 -to 0 STAT_MemWriteCountTransactions
create_bd_pin -dir O -from 31 -to 0 STAT_MemReadCountNonScanoutBytesTransferred
create_bd_pin -dir O -from 31 -to 0 STAT_MemReadCountNonScanoutTransactions

create_bd_cell -type ip -vlnv xilinx.com:ip:fifo_generator:13.2 ROPReadResponsesFIFO
set_property -dict [list \
  CONFIG.Fifo_Implementation Independent_Clocks_Builtin_FIFO \
  CONFIG.Performance_Options First_Word_Fall_Through \
  CONFIG.Input_Data_Width 286 \
  CONFIG.Input_Depth 512 \
  CONFIG.Read_Clock_Frequency 333 \
  CONFIG.Write_Clock_Frequency 333 \
] [get_bd_cells ROPReadResponsesFIFO]
create_bd_cell -type ip -vlnv xilinx.com:ip:fifo_generator:13.2 ZStencilReadRequestsFIFO
set_property -dict [list \
  CONFIG.Fifo_Implementation Independent_Clocks_Builtin_FIFO \
  CONFIG.Performance_Options First_Word_Fall_Through \
  CONFIG.Input_Data_Width 30 \
  CONFIG.Input_Depth 512 \
  CONFIG.Read_Clock_Frequency 333 \
  CONFIG.Write_Clock_Frequency 333 \
] [get_bd_cells ZStencilReadRequestsFIFO]
create_bd_cell -type ip -vlnv xilinx.com:ip:fifo_generator:13.2 ROPWriteRequestsFIFO
set_property -dict [list \
  CONFIG.Fifo_Implementation Independent_Clocks_Builtin_FIFO \
  CONFIG.Performance_Options First_Word_Fall_Through \
  CONFIG.Input_Data_Width 294 \
  CONFIG.Input_Depth 512 \
  CONFIG.Read_Clock_Frequency 333 \
  CONFIG.Write_Clock_Frequency 333 \
] [get_bd_cells ROPWriteRequestsFIFO]
create_bd_cell -type ip -vlnv xilinx.com:ip:fifo_generator:13.2 IAReadRequestsFIFO
set_property -dict [list \
  CONFIG.Fifo_Implementation Independent_Clocks_Builtin_FIFO \
  CONFIG.Performance_Options First_Word_Fall_Through \
  CONFIG.Input_Data_Width 30 \
  CONFIG.Input_Depth 512 \
  CONFIG.Read_Clock_Frequency 333 \
  CONFIG.Write_Clock_Frequency 333 \
] [get_bd_cells IAReadRequestsFIFO]
create_bd_cell -type ip -vlnv xilinx.com:ip:fifo_generator:13.2 CommandProcReadRequestsFIFO
set_property -dict [list \
  CONFIG.Fifo_Implementation Independent_Clocks_Builtin_FIFO \
  CONFIG.Performance_Options First_Word_Fall_Through \
  CONFIG.Input_Data_Width 30 \
  CONFIG.Input_Depth 512 \
  CONFIG.Read_Clock_Frequency 333 \
  CONFIG.Write_Clock_Frequency 333 \
] [get_bd_cells CommandProcReadRequestsFIFO]
create_bd_cell -type ip -vlnv xilinx.com:ip:fifo_generator:13.2 ZStencilWriteRequestsFIFO
set_property -dict [list \
  CONFIG.Fifo_Implementation Independent_Clocks_Builtin_FIFO \
  CONFIG.Performance_Options First_Word_Fall_Through \
  CONFIG.Input_Data_Width 294 \
  CONFIG.Input_Depth 512 \
  CONFIG.Read_Clock_Frequency 333 \
  CONFIG.Write_Clock_Frequency 333 \
] [get_bd_cells ZStencilWriteRequestsFIFO]
create_bd_cell -type ip -vlnv xilinx.com:ip:fifo_generator:13.2 TexFetchReadRequestsFIFO
set_property -dict [list \
  CONFIG.Fifo_Implementation Independent_Clocks_Builtin_FIFO \
  CONFIG.Performance_Options First_Word_Fall_Through \
  CONFIG.Input_Data_Width 30 \
  CONFIG.Input_Depth 512 \
  CONFIG.Read_Clock_Frequency 333 \
  CONFIG.Write_Clock_Frequency 333 \
] [get_bd_cells TexFetchReadRequestsFIFO]
create_bd_cell -type ip -vlnv xilinx.com:ip:ddr4:2.2 ddr4_0
set_property -dict [list \
  CONFIG.RESET_BOARD_INTERFACE reset \
  CONFIG.C0_CLOCK_BOARD_INTERFACE default_sysclk1_300 \
  CONFIG.C0_DDR4_BOARD_INTERFACE ddr4_sdram_c1 \
  CONFIG.C0.DDR4_AxiNarrowBurst false \
  CONFIG.C0.DDR4_AxiAddressWidth 30 \
  CONFIG.ADDN_UI_CLKOUT1_FREQ_HZ 250 \
  CONFIG.C0.BANK_GROUP_WIDTH 1 \
] [get_bd_cells ddr4_0]
create_bd_cell -type ip -vlnv xilinx.com:ip:fifo_generator:13.2 ScanoutReadRequestsFIFO
set_property -dict [list \
  CONFIG.Fifo_Implementation Independent_Clocks_Builtin_FIFO \
  CONFIG.Performance_Options First_Word_Fall_Through \
  CONFIG.Input_Data_Width 30 \
  CONFIG.Input_Depth 512 \
  CONFIG.Read_Clock_Frequency 333 \
  CONFIG.Write_Clock_Frequency 201 \
] [get_bd_cells ScanoutReadRequestsFIFO]
create_bd_cell -type ip -vlnv xilinx.com:ip:fifo_generator:13.2 ZStencilReadResponsesFIFO
set_property -dict [list \
  CONFIG.Fifo_Implementation Independent_Clocks_Builtin_FIFO \
  CONFIG.Performance_Options First_Word_Fall_Through \
  CONFIG.Input_Data_Width 286 \
  CONFIG.Input_Depth 512 \
  CONFIG.Read_Clock_Frequency 333 \
  CONFIG.Write_Clock_Frequency 333 \
] [get_bd_cells ZStencilReadResponsesFIFO]
create_bd_cell -type ip -vlnv xilinx.com:ip:fifo_generator:13.2 CommandProcWriteRequestsFIFO
set_property -dict [list \
  CONFIG.Fifo_Implementation Independent_Clocks_Builtin_FIFO \
  CONFIG.Performance_Options First_Word_Fall_Through \
  CONFIG.Input_Data_Width 294 \
  CONFIG.Input_Depth 512 \
  CONFIG.Read_Clock_Frequency 333 \
  CONFIG.Write_Clock_Frequency 333 \
] [get_bd_cells CommandProcWriteRequestsFIFO]
create_bd_cell -type ip -vlnv xilinx.com:ip:fifo_generator:13.2 IAReadResponsesFIFO
set_property -dict [list \
  CONFIG.Fifo_Implementation Independent_Clocks_Builtin_FIFO \
  CONFIG.Performance_Options First_Word_Fall_Through \
  CONFIG.Input_Data_Width 286 \
  CONFIG.Input_Depth 512 \
  CONFIG.Read_Clock_Frequency 333 \
  CONFIG.Write_Clock_Frequency 333 \
] [get_bd_cells IAReadResponsesFIFO]
create_bd_cell -type ip -vlnv xilinx.com:ip:fifo_generator:13.2 ROPReadRequestsFIFO
set_property -dict [list \
  CONFIG.Fifo_Implementation Independent_Clocks_Builtin_FIFO \
  CONFIG.Performance_Options First_Word_Fall_Through \
  CONFIG.Input_Data_Width 30 \
  CONFIG.Input_Depth 512 \
  CONFIG.Read_Clock_Frequency 333 \
  CONFIG.Write_Clock_Frequency 333 \
] [get_bd_cells ROPReadRequestsFIFO]
create_bd_cell -type ip -vlnv xilinx.com:ip:fifo_generator:13.2 ClearBlockWriteRequestsFIFO
set_property -dict [list \
  CONFIG.Fifo_Implementation Independent_Clocks_Builtin_FIFO \
  CONFIG.Performance_Options First_Word_Fall_Through \
  CONFIG.Input_Data_Width 294 \
  CONFIG.Input_Depth 512 \
  CONFIG.Read_Clock_Frequency 333 \
  CONFIG.Write_Clock_Frequency 333 \
] [get_bd_cells ClearBlockWriteRequestsFIFO]
create_bd_cell -type ip -vlnv xilinx.com:ip:fifo_generator:13.2 CommandProcReadResponsesFIFO
set_property -dict [list \
  CONFIG.Fifo_Implementation Independent_Clocks_Builtin_FIFO \
  CONFIG.Performance_Options First_Word_Fall_Through \
  CONFIG.Input_Data_Width 286 \
  CONFIG.Input_Depth 512 \
  CONFIG.Read_Clock_Frequency 333 \
  CONFIG.Write_Clock_Frequency 333 \
] [get_bd_cells CommandProcReadResponsesFIFO]
create_bd_cell -type ip -vlnv xilinx.com:ip:fifo_generator:13.2 ScanoutReadResponsesFIFO
set_property -dict [list \
  CONFIG.Fifo_Implementation Independent_Clocks_Builtin_FIFO \
  CONFIG.Performance_Options First_Word_Fall_Through \
  CONFIG.Input_Data_Width 286 \
  CONFIG.Input_Depth 512 \
  CONFIG.Read_Clock_Frequency 201 \
  CONFIG.Write_Clock_Frequency 333 \
] [get_bd_cells ScanoutReadResponsesFIFO]
create_bd_cell -type ip -vlnv xilinx.com:ip:fifo_generator:13.2 TexFetchReadResponsesFIFO
set_property -dict [list \
  CONFIG.Fifo_Implementation Independent_Clocks_Builtin_FIFO \
  CONFIG.Performance_Options First_Word_Fall_Through \
  CONFIG.Input_Data_Width 286 \
  CONFIG.Input_Depth 512 \
  CONFIG.Read_Clock_Frequency 333 \
  CONFIG.Write_Clock_Frequency 333 \
] [get_bd_cells TexFetchReadResponsesFIFO]
create_bd_cell -type ip -vlnv xilinx.com:ip:proc_sys_reset:5.0 rst_ddr4_0_333M
create_bd_cell -type ip -vlnv xilinx.com:ip:fifo_generator:13.2 StatsWriteRequestsFIFO
set_property -dict [list \
  CONFIG.Fifo_Implementation Independent_Clocks_Builtin_FIFO \
  CONFIG.Performance_Options First_Word_Fall_Through \
  CONFIG.Input_Data_Width 294 \
  CONFIG.Input_Depth 512 \
  CONFIG.Use_Embedded_Registers true \
  CONFIG.Read_Clock_Frequency 333 \
  CONFIG.Write_Clock_Frequency 333 \
] [get_bd_cells StatsWriteRequestsFIFO]
create_bd_cell -type module -reference MemoryController MemoryController_0

# ---- hierarchy /SerialPacketSystem ----
current_bd_instance /SerialPacketSystem
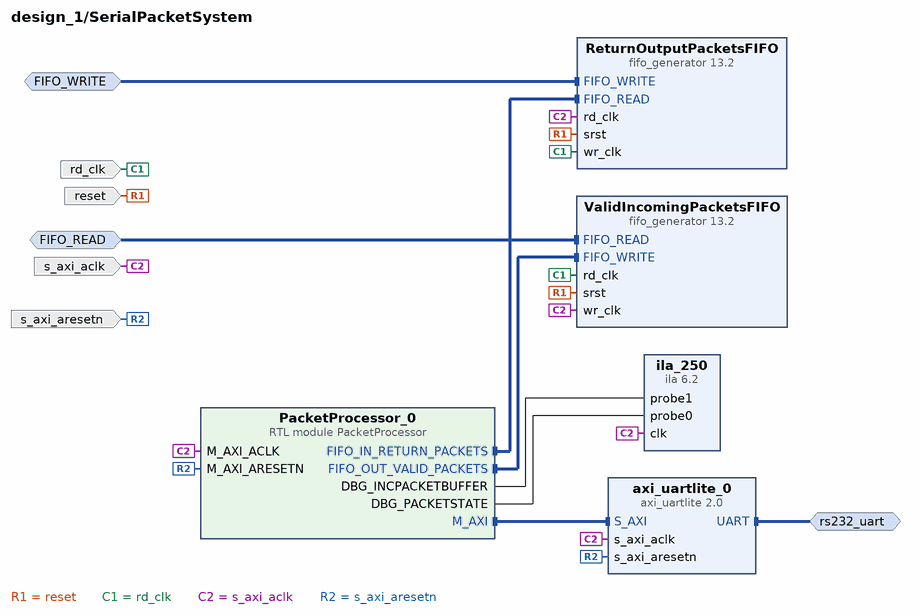
[diagram p8: block diagram inside /SerialPacketSystem]
create_bd_intf_pin -mode Slave -vlnv xilinx.com:interface:fifo_write_rtl:1.0 FIFO_WRITE
create_bd_intf_pin -mode Slave -vlnv xilinx.com:interface:fifo_read_rtl:1.0 FIFO_READ
create_bd_intf_pin -mode Master -vlnv xilinx.com:interface:uart_rtl:1.0 rs232_uart
create_bd_pin -dir I reset
create_bd_pin -dir I -type clk rd_clk
create_bd_pin -dir I -type clk s_axi_aclk
create_bd_pin -dir I -type rst s_axi_aresetn

create_bd_cell -type ip -vlnv xilinx.com:ip:fifo_generator:13.2 ReturnOutputPacketsFIFO
set_property -dict [list \
  CONFIG.Fifo_Implementation Independent_Clocks_Builtin_FIFO \
  CONFIG.Performance_Options First_Word_Fall_Through \
  CONFIG.Input_Data_Width 88 \
  CONFIG.Input_Depth 512 \
  CONFIG.Read_Clock_Frequency 250 \
  CONFIG.Write_Clock_Frequency 333 \
] [get_bd_cells ReturnOutputPacketsFIFO]
create_bd_cell -type ip -vlnv xilinx.com:ip:fifo_generator:13.2 ValidIncomingPacketsFIFO
set_property -dict [list \
  CONFIG.Fifo_Implementation Independent_Clocks_Builtin_FIFO \
  CONFIG.Performance_Options First_Word_Fall_Through \
  CONFIG.Input_Data_Width 88 \
  CONFIG.Input_Depth 512 \
  CONFIG.Use_Embedded_Registers true \
  CONFIG.Read_Clock_Frequency 333 \
  CONFIG.Write_Clock_Frequency 250 \
] [get_bd_cells ValidIncomingPacketsFIFO]
create_bd_cell -type ip -vlnv xilinx.com:ip:ila:6.2 ila_250
set_property -dict [list \
  CONFIG.C_PROBE1_TYPE 1 \
  CONFIG.C_PROBE0_TYPE 1 \
  CONFIG.C_PROBE1_WIDTH 88 \
  CONFIG.C_PROBE0_WIDTH 8 \
  CONFIG.C_NUM_OF_PROBES 2 \
  CONFIG.C_ENABLE_ILA_AXI_MON false \
  CONFIG.C_MONITOR_TYPE Native \
] [get_bd_cells ila_250]
create_bd_cell -type ip -vlnv xilinx.com:ip:axi_uartlite:2.0 axi_uartlite_0
set_property -dict [list \
  CONFIG.C_BAUDRATE 921600 \
  CONFIG.C_S_AXI_ACLK_FREQ_HZ 250000000 \
  CONFIG.C_S_AXI_ACLK_FREQ_HZ_d 250 \
  CONFIG.PARITY Odd \
  CONFIG.C_USE_PARITY 1 \
  CONFIG.C_ODD_PARITY 1 \
  CONFIG.USE_BOARD_FLOW true \
  CONFIG.UARTLITE_BOARD_INTERFACE rs232_uart \
] [get_bd_cells axi_uartlite_0]
create_bd_cell -type module -reference PacketProcessor PacketProcessor_0

# ---- hierarchy /ScanoutSystem ----
current_bd_instance /ScanoutSystem
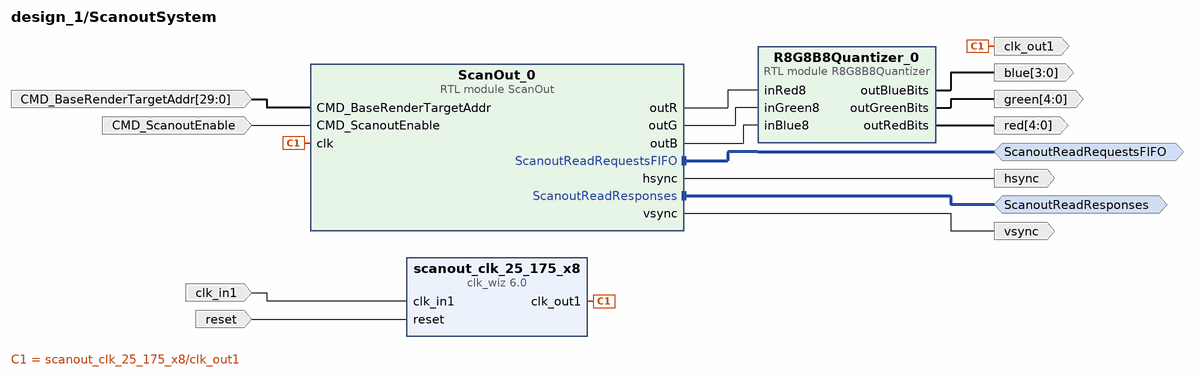
[diagram p9: block diagram inside /ScanoutSystem]
create_bd_intf_pin -mode Master -vlnv xilinx.com:interface:fifo_write_rtl:1.0 ScanoutReadRequestsFIFO
create_bd_intf_pin -mode Master -vlnv xilinx.com:interface:fifo_read_rtl:1.0 ScanoutReadResponses
create_bd_pin -dir I -from 29 -to 0 CMD_BaseRenderTargetAddr
create_bd_pin -dir O vsync
create_bd_pin -dir O hsync
create_bd_pin -dir O -from 4 -to 0 red
create_bd_pin -dir O -from 4 -to 0 green
create_bd_pin -dir O -from 3 -to 0 blue
create_bd_pin -dir I -type clk clk_in1
create_bd_pin -dir O -type clk clk_out1
create_bd_pin -dir I CMD_ScanoutEnable
create_bd_pin -dir I -type rst reset

create_bd_cell -type module -reference R8G8B8Quantizer R8G8B8Quantizer_0
create_bd_cell -type ip -vlnv xilinx.com:ip:clk_wiz:6.0 scanout_clk_25_175_x8
set_property -dict [list \
  CONFIG.CLKOUT1_REQUESTED_OUT_FREQ 201.4 \
  CONFIG.USE_LOCKED false \
  CONFIG.USE_RESET true \
  CONFIG.MMCM_DIVCLK_DIVIDE 5 \
  CONFIG.MMCM_CLKFBOUT_MULT_F 17.375 \
  CONFIG.MMCM_CLKOUT0_DIVIDE_F 5.750 \
  CONFIG.RESET_BOARD_INTERFACE reset \
  CONFIG.CLKOUT1_JITTER 109.744 \
  CONFIG.CLKOUT1_PHASE_ERROR 115.734 \
] [get_bd_cells scanout_clk_25_175_x8]
create_bd_cell -type module -reference ScanOut ScanOut_0

# ---- connections ----

current_bd_instance /MemorySystem
connect_bd_intf_net [get_bd_intf_pins MemoryController_0/ROPReadResponses] [get_bd_intf_pins ROPReadResponsesFIFO/FIFO_WRITE]
connect_bd_intf_net [get_bd_intf_pins MemoryController_0/ZStencilReadRequests] [get_bd_intf_pins ZStencilReadRequestsFIFO/FIFO_READ]
connect_bd_intf_net [get_bd_intf_pins ROPWriteRequestsFIFO/FIFO_READ] [get_bd_intf_pins MemoryController_0/ROPWriteRequests]
connect_bd_intf_net [get_bd_intf_pins MemoryController_0/IAReadRequests] [get_bd_intf_pins IAReadRequestsFIFO/FIFO_READ]
connect_bd_intf_net [get_bd_intf_pins MemoryController_0/CommandProcReadRequests] [get_bd_intf_pins CommandProcReadRequestsFIFO/FIFO_READ]
connect_bd_intf_net [get_bd_intf_pins MemoryController_0/ScanoutReadRequests] [get_bd_intf_pins ScanoutReadRequestsFIFO/FIFO_READ]
connect_bd_intf_net [get_bd_intf_pins MemoryController_0/ScanoutReadResponses] [get_bd_intf_pins ScanoutReadResponsesFIFO/FIFO_WRITE]
connect_bd_intf_net [get_bd_intf_pins MemoryController_0/ZStencilReadResponses] [get_bd_intf_pins ZStencilReadResponsesFIFO/FIFO_WRITE]
connect_bd_intf_net [get_bd_intf_pins ZStencilWriteRequestsFIFO/FIFO_READ] [get_bd_intf_pins MemoryController_0/ZStencilWriteRequests]
connect_bd_intf_net [get_bd_intf_pins MemoryController_0/CommandProcReadResponses] [get_bd_intf_pins CommandProcReadResponsesFIFO/FIFO_WRITE]
connect_bd_intf_net [get_bd_intf_pins CommandProcWriteRequestsFIFO/FIFO_READ] [get_bd_intf_pins MemoryController_0/CommandProcWriteRequests]
connect_bd_intf_net [get_bd_intf_pins MemoryController_0/IAReadResponses] [get_bd_intf_pins IAReadResponsesFIFO/FIFO_WRITE]
connect_bd_intf_net [get_bd_intf_pins MemoryController_0/TexFetchReadRequests] [get_bd_intf_pins TexFetchReadRequestsFIFO/FIFO_READ]
connect_bd_intf_net [get_bd_intf_pins MemoryController_0/TexFetchReadResponses] [get_bd_intf_pins TexFetchReadResponsesFIFO/FIFO_WRITE]
connect_bd_intf_net [get_bd_intf_pins MemoryController_0/ROPReadRequests] [get_bd_intf_pins ROPReadRequestsFIFO/FIFO_READ]
connect_bd_intf_net [get_bd_intf_pins ClearBlockWriteRequestsFIFO/FIFO_READ] [get_bd_intf_pins MemoryController_0/ClearBlockWriteRequests]
connect_bd_intf_net [get_bd_intf_pins ddr4_0/C0_DDR4_S_AXI] [get_bd_intf_pins MemoryController_0/M_AXI]
connect_bd_intf_net [get_bd_intf_pins StatsWriteRequestsFIFO/FIFO_READ] [get_bd_intf_pins MemoryController_0/StatsWriteRequests]
connect_bd_intf_net -intf_net default_sysclk1_300_1 [get_bd_intf_pins default_sysclk1_300] [get_bd_intf_pins ddr4_0/C0_SYS_CLK]
connect_bd_intf_net [get_bd_intf_pins ddr4_sdram_c1] [get_bd_intf_pins ddr4_0/C0_DDR4]
connect_bd_intf_net [get_bd_intf_pins FIFO_WRITE] [get_bd_intf_pins CommandProcReadRequestsFIFO/FIFO_WRITE]
connect_bd_intf_net [get_bd_intf_pins FIFO_READ] [get_bd_intf_pins CommandProcReadResponsesFIFO/FIFO_READ]
connect_bd_intf_net [get_bd_intf_pins FIFO_WRITE1] [get_bd_intf_pins CommandProcWriteRequestsFIFO/FIFO_WRITE]
connect_bd_intf_net [get_bd_intf_pins FIFO_WRITE2] [get_bd_intf_pins IAReadRequestsFIFO/FIFO_WRITE]
connect_bd_intf_net [get_bd_intf_pins FIFO_READ1] [get_bd_intf_pins IAReadResponsesFIFO/FIFO_READ]
connect_bd_intf_net [get_bd_intf_pins FIFO_WRITE3] [get_bd_intf_pins TexFetchReadRequestsFIFO/FIFO_WRITE]
connect_bd_intf_net [get_bd_intf_pins FIFO_READ2] [get_bd_intf_pins TexFetchReadResponsesFIFO/FIFO_READ]
connect_bd_intf_net [get_bd_intf_pins FIFO_WRITE4] [get_bd_intf_pins ROPReadRequestsFIFO/FIFO_WRITE]
connect_bd_intf_net [get_bd_intf_pins FIFO_READ3] [get_bd_intf_pins ROPReadResponsesFIFO/FIFO_READ]
connect_bd_intf_net [get_bd_intf_pins FIFO_WRITE5] [get_bd_intf_pins ROPWriteRequestsFIFO/FIFO_WRITE]
connect_bd_intf_net [get_bd_intf_pins FIFO_WRITE6] [get_bd_intf_pins ScanoutReadRequestsFIFO/FIFO_WRITE]
connect_bd_intf_net [get_bd_intf_pins FIFO_READ4] [get_bd_intf_pins ScanoutReadResponsesFIFO/FIFO_READ]
connect_bd_intf_net [get_bd_intf_pins FIFO_WRITE7] [get_bd_intf_pins ClearBlockWriteRequestsFIFO/FIFO_WRITE]
connect_bd_intf_net [get_bd_intf_pins FIFO_WRITE8] [get_bd_intf_pins StatsWriteRequestsFIFO/FIFO_WRITE]
connect_bd_net [get_bd_pins ddr4_0/c0_ddr4_ui_clk_sync_rst] [get_bd_pins rst_ddr4_0_333M/ext_reset_in]
connect_bd_net [get_bd_pins rst_ddr4_0_333M/peripheral_aresetn] [get_bd_pins ddr4_0/c0_ddr4_aresetn]
connect_bd_net [get_bd_pins ddr4_0/c0_ddr4_ui_clk] \
  [get_bd_pins c0_ddr4_ui_clk] [get_bd_pins ScanoutReadRequestsFIFO/rd_clk] [get_bd_pins ZStencilReadRequestsFIFO/rd_clk] \
  [get_bd_pins ZStencilReadRequestsFIFO/wr_clk] [get_bd_pins ROPReadRequestsFIFO/wr_clk] \
  [get_bd_pins ROPReadResponsesFIFO/rd_clk] [get_bd_pins ROPWriteRequestsFIFO/wr_clk] \
  [get_bd_pins ClearBlockWriteRequestsFIFO/wr_clk] [get_bd_pins TexFetchReadResponsesFIFO/rd_clk] \
  [get_bd_pins TexFetchReadRequestsFIFO/wr_clk] [get_bd_pins IAReadResponsesFIFO/rd_clk] \
  [get_bd_pins IAReadRequestsFIFO/wr_clk] [get_bd_pins CommandProcWriteRequestsFIFO/wr_clk] \
  [get_bd_pins CommandProcReadResponsesFIFO/rd_clk] [get_bd_pins CommandProcReadRequestsFIFO/wr_clk] \
  [get_bd_pins ZStencilReadResponsesFIFO/rd_clk] [get_bd_pins ZStencilWriteRequestsFIFO/wr_clk] \
  [get_bd_pins ClearBlockWriteRequestsFIFO/rd_clk] [get_bd_pins ROPWriteRequestsFIFO/rd_clk] \
  [get_bd_pins ROPReadRequestsFIFO/rd_clk] [get_bd_pins TexFetchReadResponsesFIFO/wr_clk] \
  [get_bd_pins TexFetchReadRequestsFIFO/rd_clk] [get_bd_pins IAReadResponsesFIFO/wr_clk] \
  [get_bd_pins IAReadRequestsFIFO/rd_clk] [get_bd_pins CommandProcWriteRequestsFIFO/rd_clk] \
  [get_bd_pins CommandProcReadResponsesFIFO/wr_clk] [get_bd_pins CommandProcReadRequestsFIFO/rd_clk] \
  [get_bd_pins ZStencilWriteRequestsFIFO/rd_clk] [get_bd_pins ZStencilReadResponsesFIFO/wr_clk] \
  [get_bd_pins ScanoutReadResponsesFIFO/wr_clk] [get_bd_pins rst_ddr4_0_333M/slowest_sync_clk] \
  [get_bd_pins ROPReadResponsesFIFO/wr_clk] [get_bd_pins StatsWriteRequestsFIFO/wr_clk] \
  [get_bd_pins StatsWriteRequestsFIFO/rd_clk] [get_bd_pins MemoryController_0/M_AXI_ACLK]
connect_bd_net -net ResetN_UntilClockLoc_0_resetn [get_bd_pins M_AXI_ARESETN] [get_bd_pins MemoryController_0/M_AXI_ARESETN]
connect_bd_net [get_bd_pins ddr4_0/addn_ui_clkout1] [get_bd_pins addn_ui_clkout1]
connect_bd_net [get_bd_pins reset] [get_bd_pins ddr4_0/sys_rst]
connect_bd_net [get_bd_pins MemoryController_0/CMD_MemoryControllerIsIdle] [get_bd_pins CMD_MemoryControllerIsIdle]
connect_bd_net [get_bd_pins rd_clk] [get_bd_pins ScanoutReadResponsesFIFO/rd_clk] [get_bd_pins ScanoutReadRequestsFIFO/wr_clk]
connect_bd_net [get_bd_pins MemoryController_0/DBG_ReadState] [get_bd_pins DBG_ReadState]
connect_bd_net [get_bd_pins MemoryController_0/DBG_WriteState] [get_bd_pins DBG_WriteState]
connect_bd_net [get_bd_pins MemoryController_0/DBG_ReadControlState] [get_bd_pins DBG_ReadControlState]
connect_bd_net [get_bd_pins MemoryController_0/DBG_WriteControlState] [get_bd_pins DBG_WriteControlState]
connect_bd_net [get_bd_pins MemoryController_0/DBG_NewReadEnable] [get_bd_pins DBG_NewReadEnable]
connect_bd_net [get_bd_pins MemoryController_0/DBG_NewReadDataReady] [get_bd_pins DBG_NewReadDataReady]
connect_bd_net [get_bd_pins MemoryController_0/DBG_ReadyForNewRead] [get_bd_pins DBG_ReadyForNewRead]
connect_bd_net [get_bd_pins MemoryController_0/DBG_ScanoutReadRequests_Empty] [get_bd_pins DBG_ScanoutReadRequests_Empty]
connect_bd_net [get_bd_pins MemoryController_0/DBG_ScanoutReadResponses_Full] [get_bd_pins DBG_ScanoutReadResponses_Full]
connect_bd_net [get_bd_pins MemoryController_0/DBG_ScanoutReadRequests_rd_en] [get_bd_pins DBG_ScanoutReadRequests_rd_en]
connect_bd_net [get_bd_pins MemoryController_0/DBG_LastWriteAddress] [get_bd_pins DBG_LastWriteAddress]
connect_bd_net [get_bd_pins MemoryController_0/DBG_LastWriteData] [get_bd_pins DBG_LastWriteData]
connect_bd_net [get_bd_pins MemoryController_0/DBG_LastWriteDataDWORDEnables] [get_bd_pins DBG_LastWriteDataDWORDEnables]
connect_bd_net [get_bd_pins MemoryController_0/DBG_LastWriteMemoryClientIndex] [get_bd_pins DBG_LastWriteMemoryClientIndex]
connect_bd_net [get_bd_pins MemoryController_0/DBG_LastReadAddress] [get_bd_pins DBG_LastReadAddress]
connect_bd_net [get_bd_pins MemoryController_0/DBG_LastReadMemoryClientIndex] [get_bd_pins DBG_LastReadMemoryClientIndex]
connect_bd_net [get_bd_pins ddr4_0/c0_init_calib_complete] [get_bd_pins MemoryController_0/c0_init_calib_complete]
connect_bd_net [get_bd_pins MemoryController_0/STAT_MemReadCyclesIdle] [get_bd_pins STAT_MemReadCyclesIdle]
connect_bd_net [get_bd_pins MemoryController_0/STAT_MemReadCyclesSpentWorking] [get_bd_pins STAT_MemReadCyclesSpentWorking]
connect_bd_net [get_bd_pins MemoryController_0/STAT_MemWriteCyclesIdle] [get_bd_pins STAT_MemWriteCyclesIdle]
connect_bd_net [get_bd_pins MemoryController_0/STAT_MemWriteCyclesSpentWorking] [get_bd_pins STAT_MemWriteCyclesSpentWorking]
connect_bd_net [get_bd_pins MemoryController_0/STAT_MemReadCountBytesTransferred] [get_bd_pins STAT_MemReadCountBytesTransferred]
connect_bd_net [get_bd_pins MemoryController_0/STAT_MemReadCountTransactions] [get_bd_pins STAT_MemReadCountTransactions]
connect_bd_net [get_bd_pins MemoryController_0/STAT_MemWriteCountBytesTransferred] [get_bd_pins STAT_MemWriteCountBytesTransferred]
connect_bd_net [get_bd_pins MemoryController_0/STAT_MemWriteCountTransactions] [get_bd_pins STAT_MemWriteCountTransactions]
connect_bd_net [get_bd_pins MemoryController_0/STAT_MemReadCountNonScanoutBytesTransferred] [get_bd_pins STAT_MemReadCountNonScanoutBytesTransferred]
connect_bd_net [get_bd_pins MemoryController_0/STAT_MemReadCountNonScanoutTransactions] [get_bd_pins STAT_MemReadCountNonScanoutTransactions]

current_bd_instance /SerialPacketSystem
connect_bd_intf_net [get_bd_intf_pins PacketProcessor_0/FIFO_IN_RETURN_PACKETS] [get_bd_intf_pins ReturnOutputPacketsFIFO/FIFO_READ]
connect_bd_intf_net [get_bd_intf_pins PacketProcessor_0/FIFO_OUT_VALID_PACKETS] [get_bd_intf_pins ValidIncomingPacketsFIFO/FIFO_WRITE]
connect_bd_intf_net [get_bd_intf_pins PacketProcessor_0/M_AXI] [get_bd_intf_pins axi_uartlite_0/S_AXI]
connect_bd_intf_net -intf_net CommandProcessor_0_returnPacketsFIFO [get_bd_intf_pins FIFO_WRITE] [get_bd_intf_pins ReturnOutputPacketsFIFO/FIFO_WRITE]
connect_bd_intf_net -intf_net CommandProcessor_0_validPacketsFIFO [get_bd_intf_pins FIFO_READ] [get_bd_intf_pins ValidIncomingPacketsFIFO/FIFO_READ]
connect_bd_intf_net [get_bd_intf_pins rs232_uart] [get_bd_intf_pins axi_uartlite_0/UART]
connect_bd_net [get_bd_pins reset] [get_bd_pins ValidIncomingPacketsFIFO/srst] [get_bd_pins ReturnOutputPacketsFIFO/srst]
connect_bd_net -net ddr4_0_c0_ddr4_ui_clk [get_bd_pins rd_clk] \
  [get_bd_pins ValidIncomingPacketsFIFO/rd_clk] [get_bd_pins ReturnOutputPacketsFIFO/wr_clk]
connect_bd_net -net ddr4_0_addn_ui_clkout1 [get_bd_pins s_axi_aclk] \
  [get_bd_pins ValidIncomingPacketsFIFO/wr_clk] [get_bd_pins ReturnOutputPacketsFIFO/rd_clk] [get_bd_pins ila_250/clk] \
  [get_bd_pins axi_uartlite_0/s_axi_aclk] [get_bd_pins PacketProcessor_0/M_AXI_ACLK]
connect_bd_net -net ResetN_UntilClockLoc_0_resetn [get_bd_pins s_axi_aresetn] \
  [get_bd_pins axi_uartlite_0/s_axi_aresetn] [get_bd_pins PacketProcessor_0/M_AXI_ARESETN]
connect_bd_net [get_bd_pins PacketProcessor_0/DBG_INCPACKETBUFFER] [get_bd_pins ila_250/probe1]
connect_bd_net [get_bd_pins PacketProcessor_0/DBG_PACKETSTATE] [get_bd_pins ila_250/probe0]

current_bd_instance /ScanoutSystem
connect_bd_intf_net [get_bd_intf_pins ScanoutReadRequestsFIFO] [get_bd_intf_pins ScanOut_0/ScanoutReadRequestsFIFO]
connect_bd_intf_net [get_bd_intf_pins ScanoutReadResponses] [get_bd_intf_pins ScanOut_0/ScanoutReadResponses]
connect_bd_net -net clk_wiz_0_clk_out1 [get_bd_pins scanout_clk_25_175_x8/clk_out1] [get_bd_pins clk_out1] [get_bd_pins ScanOut_0/clk]
connect_bd_net -net CommandProcessor_0_SCANOUT_RenderTargetBaseAddr [get_bd_pins CMD_BaseRenderTargetAddr] \
  [get_bd_pins ScanOut_0/CMD_BaseRenderTargetAddr]
connect_bd_net [get_bd_pins ScanOut_0/vsync] [get_bd_pins vsync]
connect_bd_net [get_bd_pins ScanOut_0/hsync] [get_bd_pins hsync]
connect_bd_net [get_bd_pins R8G8B8Quantizer_0/outRedBits] [get_bd_pins red]
connect_bd_net [get_bd_pins R8G8B8Quantizer_0/outGreenBits] [get_bd_pins green]
connect_bd_net [get_bd_pins R8G8B8Quantizer_0/outBlueBits] [get_bd_pins blue]
connect_bd_net -net ddr4_0_c0_ddr4_ui_clk [get_bd_pins clk_in1] [get_bd_pins scanout_clk_25_175_x8/clk_in1]
connect_bd_net [get_bd_pins CMD_ScanoutEnable] [get_bd_pins ScanOut_0/CMD_ScanoutEnable]
connect_bd_net [get_bd_pins reset] [get_bd_pins scanout_clk_25_175_x8/reset]
connect_bd_net [get_bd_pins ScanOut_0/outR] [get_bd_pins R8G8B8Quantizer_0/inRed8]
connect_bd_net [get_bd_pins ScanOut_0/outG] [get_bd_pins R8G8B8Quantizer_0/inGreen8]
connect_bd_net [get_bd_pins ScanOut_0/outB] [get_bd_pins R8G8B8Quantizer_0/inBlue8]

current_bd_instance /
connect_bd_intf_net [get_bd_intf_pins SerialPacketSystem/FIFO_WRITE] [get_bd_intf_pins CommandProcessor_0/returnPacketsFIFO]
connect_bd_intf_net [get_bd_intf_pins CommandProcessor_0/validPacketsFIFO] [get_bd_intf_pins SerialPacketSystem/FIFO_READ]
connect_bd_intf_net [get_bd_intf_pins CommandProcessor_0/CommandProcReadRequestsFIFO] [get_bd_intf_pins MemorySystem/FIFO_WRITE]
connect_bd_intf_net [get_bd_intf_pins CommandProcessor_0/CommandProcReadResponses] [get_bd_intf_pins MemorySystem/FIFO_READ]
connect_bd_intf_net [get_bd_intf_pins CommandProcessor_0/CommandProcWriteRequests] [get_bd_intf_pins MemorySystem/FIFO_WRITE1]
connect_bd_intf_net [get_bd_intf_pins InputAssembler_0/IAReadRequests] [get_bd_intf_pins MemorySystem/FIFO_WRITE2]
connect_bd_intf_net [get_bd_intf_pins InputAssembler_0/IAReadResponses] [get_bd_intf_pins MemorySystem/FIFO_READ1]
connect_bd_intf_net [get_bd_intf_pins InputAssembler_0/IBCache] [get_bd_intf_pins IndexBufferCache/BRAM_PORTA]
connect_bd_intf_net [get_bd_intf_pins Rasterizer_0/RASTOUT_FIFO] [get_bd_intf_pins rast_out_fifo/FIFO_WRITE]
connect_bd_intf_net [get_bd_intf_pins AttrInterpolator_0/RASTOUT_FIFO] [get_bd_intf_pins rast_out_fifo/FIFO_READ]
connect_bd_intf_net [get_bd_intf_pins TexSample_0/TexSampReadRequestsFIFO] [get_bd_intf_pins MemorySystem/FIFO_WRITE3]
connect_bd_intf_net [get_bd_intf_pins TexSample_0/TexSampReadResponses] [get_bd_intf_pins MemorySystem/FIFO_READ2]
connect_bd_intf_net [get_bd_intf_pins ROP_0/ROPReadRequestsFIFO] [get_bd_intf_pins MemorySystem/FIFO_WRITE4]
connect_bd_intf_net [get_bd_intf_pins ROP_0/ROPReadResponses] [get_bd_intf_pins MemorySystem/FIFO_READ3]
connect_bd_intf_net [get_bd_intf_pins ROP_0/ROPWriteRequestsFIFO] [get_bd_intf_pins MemorySystem/FIFO_WRITE5]
connect_bd_intf_net -intf_net ScanOut_0_ScanoutReadRequestsFIFO [get_bd_intf_pins ScanoutSystem/ScanoutReadRequestsFIFO] [get_bd_intf_pins MemorySystem/FIFO_WRITE6]
connect_bd_intf_net -intf_net ScanOut_0_ScanoutReadResponses [get_bd_intf_pins ScanoutSystem/ScanoutReadResponses] [get_bd_intf_pins MemorySystem/FIFO_READ4]
connect_bd_intf_net [get_bd_intf_pins ClearBlock_0/ClearBlockWriteRequestsFIFO] [get_bd_intf_pins MemorySystem/FIFO_WRITE7]
connect_bd_intf_net [get_bd_intf_pins InputAssembler_0/VBXPosCache] [get_bd_intf_pins vertPosX_cache/BRAM_PORTA]
connect_bd_intf_net [get_bd_intf_pins InputAssembler_0/VBYPosCache] [get_bd_intf_pins vertPosY_cache/BRAM_PORTA]
connect_bd_intf_net [get_bd_intf_pins InputAssembler_0/VBInvZPosCache] [get_bd_intf_pins vertPosInvZ_cache/BRAM_PORTA]
connect_bd_intf_net [get_bd_intf_pins InputAssembler_0/VBTexXCache] [get_bd_intf_pins texcoordX_cache/BRAM_PORTA]
connect_bd_intf_net [get_bd_intf_pins InputAssembler_0/VBTexYCache] [get_bd_intf_pins texcoordY_cache/BRAM_PORTA]
connect_bd_intf_net [get_bd_intf_pins InputAssembler_0/VBColorCache] [get_bd_intf_pins vertColor_cache/BRAM_PORTA]
connect_bd_intf_net [get_bd_intf_pins TextureCache_128x128x32bits/BRAM_PORTA] [get_bd_intf_pins TexSample_0/TexCache]
connect_bd_intf_net [get_bd_intf_pins StatsCollector_0/StatsWriteRequestsFIFO] [get_bd_intf_pins MemorySystem/FIFO_WRITE8]
connect_bd_intf_net [get_bd_intf_ports rs232_uart] [get_bd_intf_pins SerialPacketSystem/rs232_uart]
connect_bd_intf_net -intf_net default_sysclk1_300_1 [get_bd_intf_ports default_sysclk1_300] [get_bd_intf_pins MemorySystem/default_sysclk1_300]
connect_bd_intf_net -intf_net ddr4_0_C0_DDR4 [get_bd_intf_ports ddr4_sdram_c1] [get_bd_intf_pins MemorySystem/ddr4_sdram_c1]
connect_bd_net [get_bd_ports reset] \
  [get_bd_pins proc_sys_reset_0/ext_reset_in] [get_bd_pins ResetN_UntilClockLoc_0/reset] [get_bd_pins MemorySystem/reset] \
  [get_bd_pins SerialPacketSystem/reset] [get_bd_pins ScanoutSystem/reset]
connect_bd_net [get_bd_pins ResetN_UntilClockLoc_0/resetn] \
  [get_bd_pins CommandProcessor_0/resetn] [get_bd_pins MemorySystem/M_AXI_ARESETN] \
  [get_bd_pins SerialPacketSystem/s_axi_aresetn]
connect_bd_net -net CommandProcessor_0_DBG_PACKETSTATE [get_bd_pins CommandProcessor_0/DBG_CMDPACKETSTATE] [get_bd_pins ila_333_250/probe0]
connect_bd_net -net ddr4_0_addn_ui_clkout1 [get_bd_pins MemorySystem/addn_ui_clkout1] \
  [get_bd_pins proc_sys_reset_0/slowest_sync_clk] [get_bd_pins SerialPacketSystem/s_axi_aclk]
connect_bd_net -net ddr4_0_c0_ddr4_ui_clk [get_bd_pins MemorySystem/c0_ddr4_ui_clk] \
  [get_bd_pins ila_333_250/clk] [get_bd_pins IndexBufferCache/clka] [get_bd_pins rast_out_fifo/clk] \
  [get_bd_pins ClearBlock_0/clk] [get_bd_pins ILA_IA/clk] [get_bd_pins vertPosX_cache/clka] \
  [get_bd_pins texcoordX_cache/clka] [get_bd_pins texcoordY_cache/clka] [get_bd_pins vertColor_cache/clka] \
  [get_bd_pins vertPosY_cache/clka] [get_bd_pins vertPosInvZ_cache/clka] [get_bd_pins ILA_TriSetup/clk] \
  [get_bd_pins ILA_AttrInterpolator/clk] [get_bd_pins ILA_TexSampler/clk] [get_bd_pins TextureCache_128x128x32bits/clka] \
  [get_bd_pins TriSetupRecip/clk] [get_bd_pins InterpolatorRecip/clk] [get_bd_pins TriWorkCache_0/clk] \
  [get_bd_pins TriSetup_0/clk] [get_bd_pins Rasterizer_0/clk] [get_bd_pins AttrInterpolator_0/clk] \
  [get_bd_pins StatsCollector_0/clk] [get_bd_pins CommandProcessor_0/clk] [get_bd_pins ROP_0/clk] \
  [get_bd_pins TexSample_0/clk] [get_bd_pins InputAssembler_0/clk] [get_bd_pins SerialPacketSystem/rd_clk] \
  [get_bd_pins ScanoutSystem/clk_in1]
connect_bd_net -net xlconstant_0_dout [get_bd_pins constant_always_locked/dout] [get_bd_pins ResetN_UntilClockLoc_0/locked]
connect_bd_net [get_bd_pins MemorySystem/CMD_MemoryControllerIsIdle] [get_bd_pins CommandProcessor_0/CMD_MemController_Idle]
connect_bd_net [get_bd_pins CommandProcessor_0/DBG_LAST_IN_PACKET] [get_bd_pins ila_333_250/probe1]
connect_bd_net [get_bd_pins CommandProcessor_0/DBG_LAST_OUT_PACKET] [get_bd_pins ila_333_250/probe2]
connect_bd_net [get_bd_pins CommandProcessor_0/DBG_LAST_READ_DATA] [get_bd_pins ila_333_250/probe3]
connect_bd_net [get_bd_pins InputAssembler_0/CMD_IA_Idle] [get_bd_pins CommandProcessor_0/CMD_IA_Idle]
connect_bd_net [get_bd_pins InputAssembler_0/CMD_DrawReady] [get_bd_pins CommandProcessor_0/IA_DrawReady]
connect_bd_net [get_bd_pins InputAssembler_0/CMD_LoadBufferReady] [get_bd_pins CommandProcessor_0/IA_LoadBufferReady]
connect_bd_net [get_bd_pins CommandProcessor_0/IA_LaunchDrawSignal] [get_bd_pins InputAssembler_0/CMD_LaunchDrawSignal]
connect_bd_net [get_bd_pins CommandProcessor_0/IA_DrawIsIndexed] [get_bd_pins InputAssembler_0/CMD_DrawIsIndexed]
connect_bd_net [get_bd_pins CommandProcessor_0/IA_DrawIndexCount] [get_bd_pins InputAssembler_0/CMD_DrawIndexCount]
connect_bd_net [get_bd_pins CommandProcessor_0/IA_LoadBufferEnable] [get_bd_pins InputAssembler_0/CMD_LoadBufferEnable]
connect_bd_net [get_bd_pins CommandProcessor_0/IA_LoadBufferAddress] [get_bd_pins InputAssembler_0/CMD_LoadBufferAddress]
connect_bd_net [get_bd_pins CommandProcessor_0/IA_LoadBufferType] [get_bd_pins InputAssembler_0/CMD_LoadBufferType]
connect_bd_net [get_bd_pins CommandProcessor_0/IA_LoadBufferElementCount] [get_bd_pins InputAssembler_0/CMD_LoadBufferElementCount]
connect_bd_net [get_bd_pins placeholder_texcfg/dout] [get_bd_pins TriSetup_0/TEXCFG_nointerpolation]
connect_bd_net [get_bd_pins TriSetup_0/IA_readyForNewTri] [get_bd_pins InputAssembler_0/TRISETUP_readyForNewTri]
connect_bd_net [get_bd_pins InputAssembler_0/TRISETUP_v0PosX] [get_bd_pins ILA_IA/probe0] [get_bd_pins TriSetup_0/IA_v0_in_x]
connect_bd_net [get_bd_pins InputAssembler_0/TRISETUP_v0PosY] [get_bd_pins ILA_IA/probe1] [get_bd_pins TriSetup_0/IA_v0_in_y]
connect_bd_net [get_bd_pins InputAssembler_0/TRISETUP_v0PosInvZ] [get_bd_pins ILA_IA/probe2] [get_bd_pins TriSetup_0/IA_v0_in_invZ]
connect_bd_net [get_bd_pins InputAssembler_0/TRISETUP_v1PosX] [get_bd_pins ILA_IA/probe11] [get_bd_pins TriSetup_0/IA_v1_in_x]
connect_bd_net [get_bd_pins InputAssembler_0/TRISETUP_v1PosY] [get_bd_pins ILA_IA/probe12] [get_bd_pins TriSetup_0/IA_v1_in_y]
connect_bd_net [get_bd_pins InputAssembler_0/TRISETUP_v1PosInvZ] [get_bd_pins TriSetup_0/IA_v1_in_invZ]
connect_bd_net [get_bd_pins InputAssembler_0/TRISETUP_v2PosX] [get_bd_pins ILA_IA/probe13] [get_bd_pins TriSetup_0/IA_v2_in_x]
connect_bd_net [get_bd_pins InputAssembler_0/TRISETUP_v2PosY] [get_bd_pins ILA_IA/probe14] [get_bd_pins TriSetup_0/IA_v2_in_y]
connect_bd_net [get_bd_pins InputAssembler_0/TRISETUP_v2PosInvZ] [get_bd_pins TriSetup_0/IA_v2_in_invZ]
connect_bd_net [get_bd_pins InputAssembler_0/TRISETUP_tex0_X] [get_bd_pins ILA_IA/probe3] [get_bd_pins TriSetup_0/IA_t0_in_x]
connect_bd_net [get_bd_pins InputAssembler_0/TRISETUP_tex0_Y] [get_bd_pins ILA_IA/probe4] [get_bd_pins TriSetup_0/IA_t0_in_y]
connect_bd_net [get_bd_pins InputAssembler_0/TRISETUP_tex1_X] [get_bd_pins TriSetup_0/IA_t1_in_x]
connect_bd_net [get_bd_pins InputAssembler_0/TRISETUP_tex1_Y] [get_bd_pins TriSetup_0/IA_t1_in_y]
connect_bd_net [get_bd_pins InputAssembler_0/TRISETUP_tex2_X] [get_bd_pins TriSetup_0/IA_t2_in_x]
connect_bd_net [get_bd_pins InputAssembler_0/TRISETUP_tex2_Y] [get_bd_pins TriSetup_0/IA_t2_in_y]
connect_bd_net [get_bd_pins InputAssembler_0/TRISETUP_vertColor0_RGBA] [get_bd_pins ILA_IA/probe5] [get_bd_pins TriSetup_0/IA_v0_in_RGBA]
connect_bd_net [get_bd_pins InputAssembler_0/TRISETUP_vertColor1_RGBA] [get_bd_pins TriSetup_0/IA_v1_in_RGBA]
connect_bd_net [get_bd_pins InputAssembler_0/TRISETUP_vertColor2_RGBA] [get_bd_pins TriSetup_0/IA_v2_in_RGBA]
connect_bd_net [get_bd_pins InputAssembler_0/TRISETUP_newTriBegin] [get_bd_pins TriSetup_0/IA_newTriBegin]
connect_bd_net [get_bd_pins no_reset/dout] [get_bd_pins rast_out_fifo/srst]
connect_bd_net [get_bd_pins Rasterizer_0/CMD_Rasterizer_Idle] [get_bd_pins CommandProcessor_0/CMD_Rasterizer_Idle]
connect_bd_net [get_bd_pins TriSetup_0/RAST_outMinX] [get_bd_pins ILA_TriSetup/probe13] [get_bd_pins Rasterizer_0/TRISETUP_inMinX]
connect_bd_net [get_bd_pins TriSetup_0/RAST_outMaxX] [get_bd_pins ILA_TriSetup/probe14] [get_bd_pins Rasterizer_0/TRISETUP_inMaxX]
connect_bd_net [get_bd_pins TriSetup_0/RAST_outMinY] [get_bd_pins ILA_TriSetup/probe15] [get_bd_pins Rasterizer_0/TRISETUP_inMinY]
